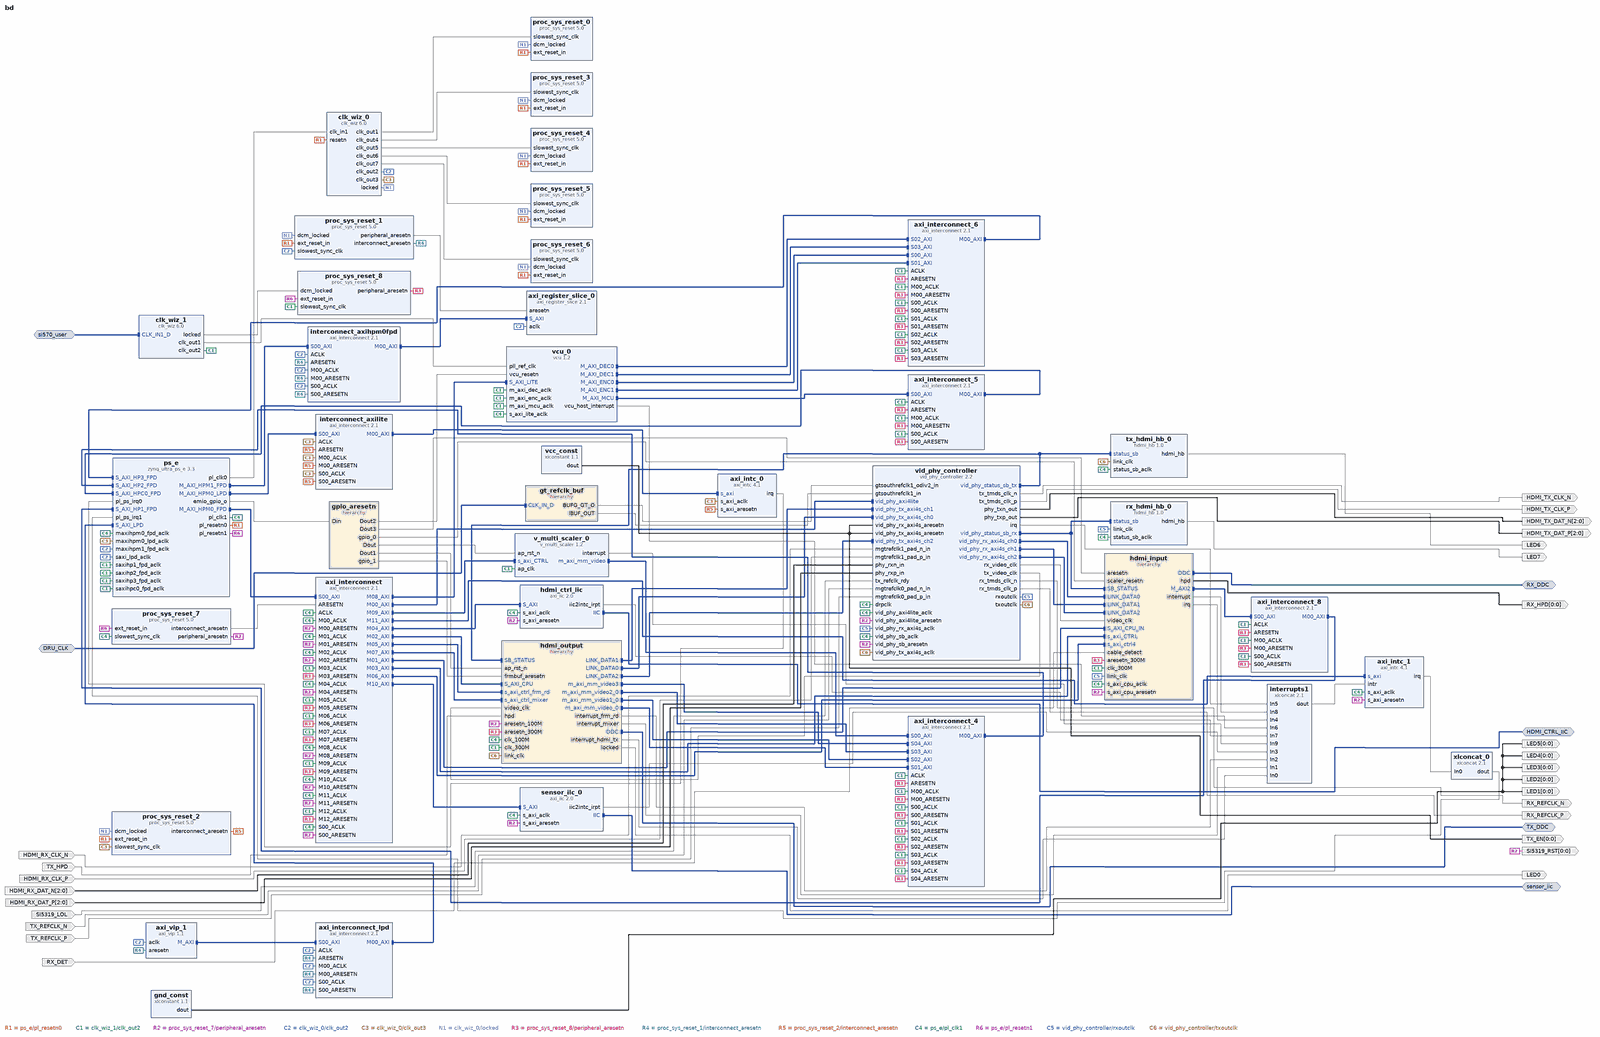
[diagram p0: block diagram of the top level, whole]
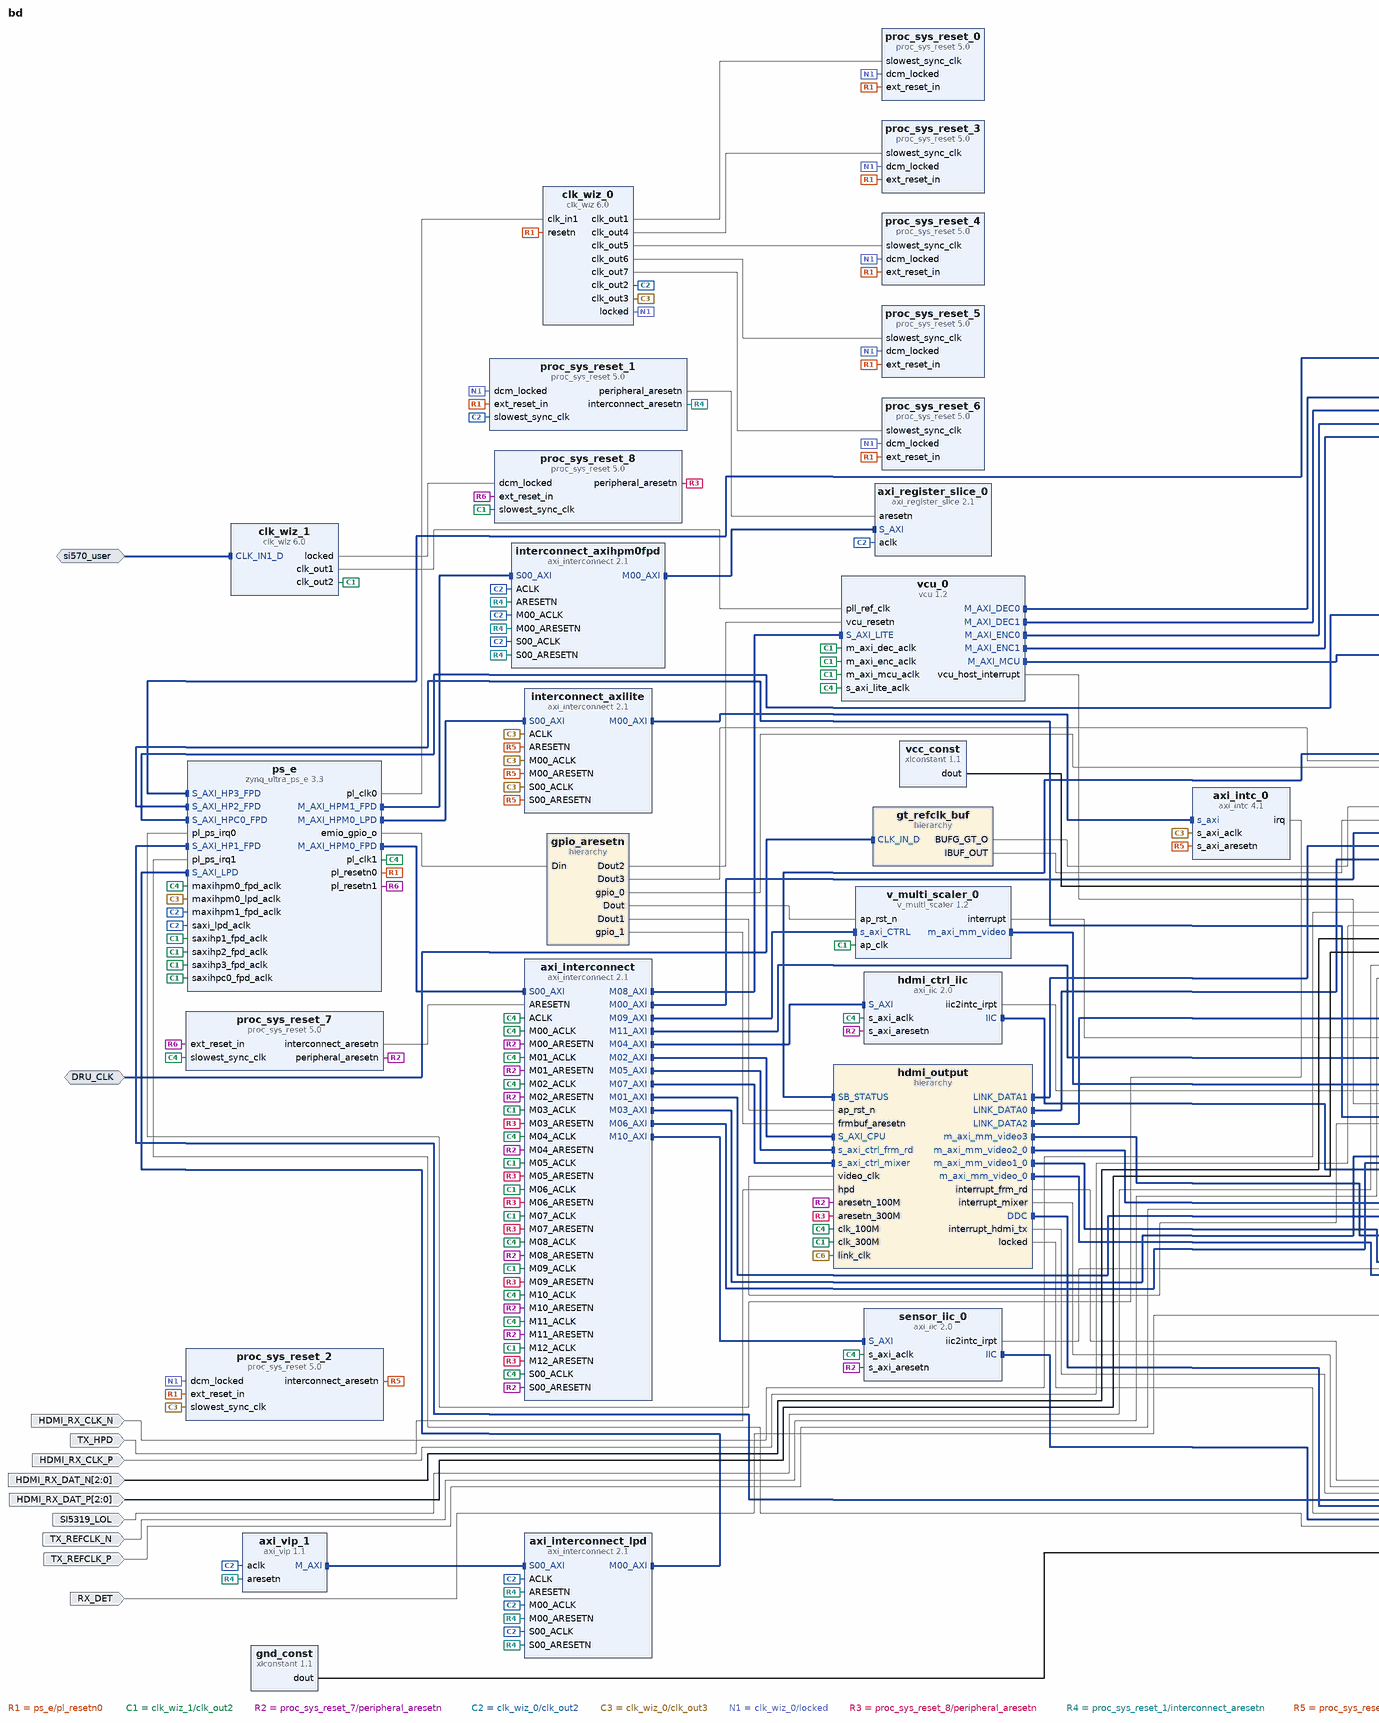
[diagram p1: block diagram of the top level, left part]
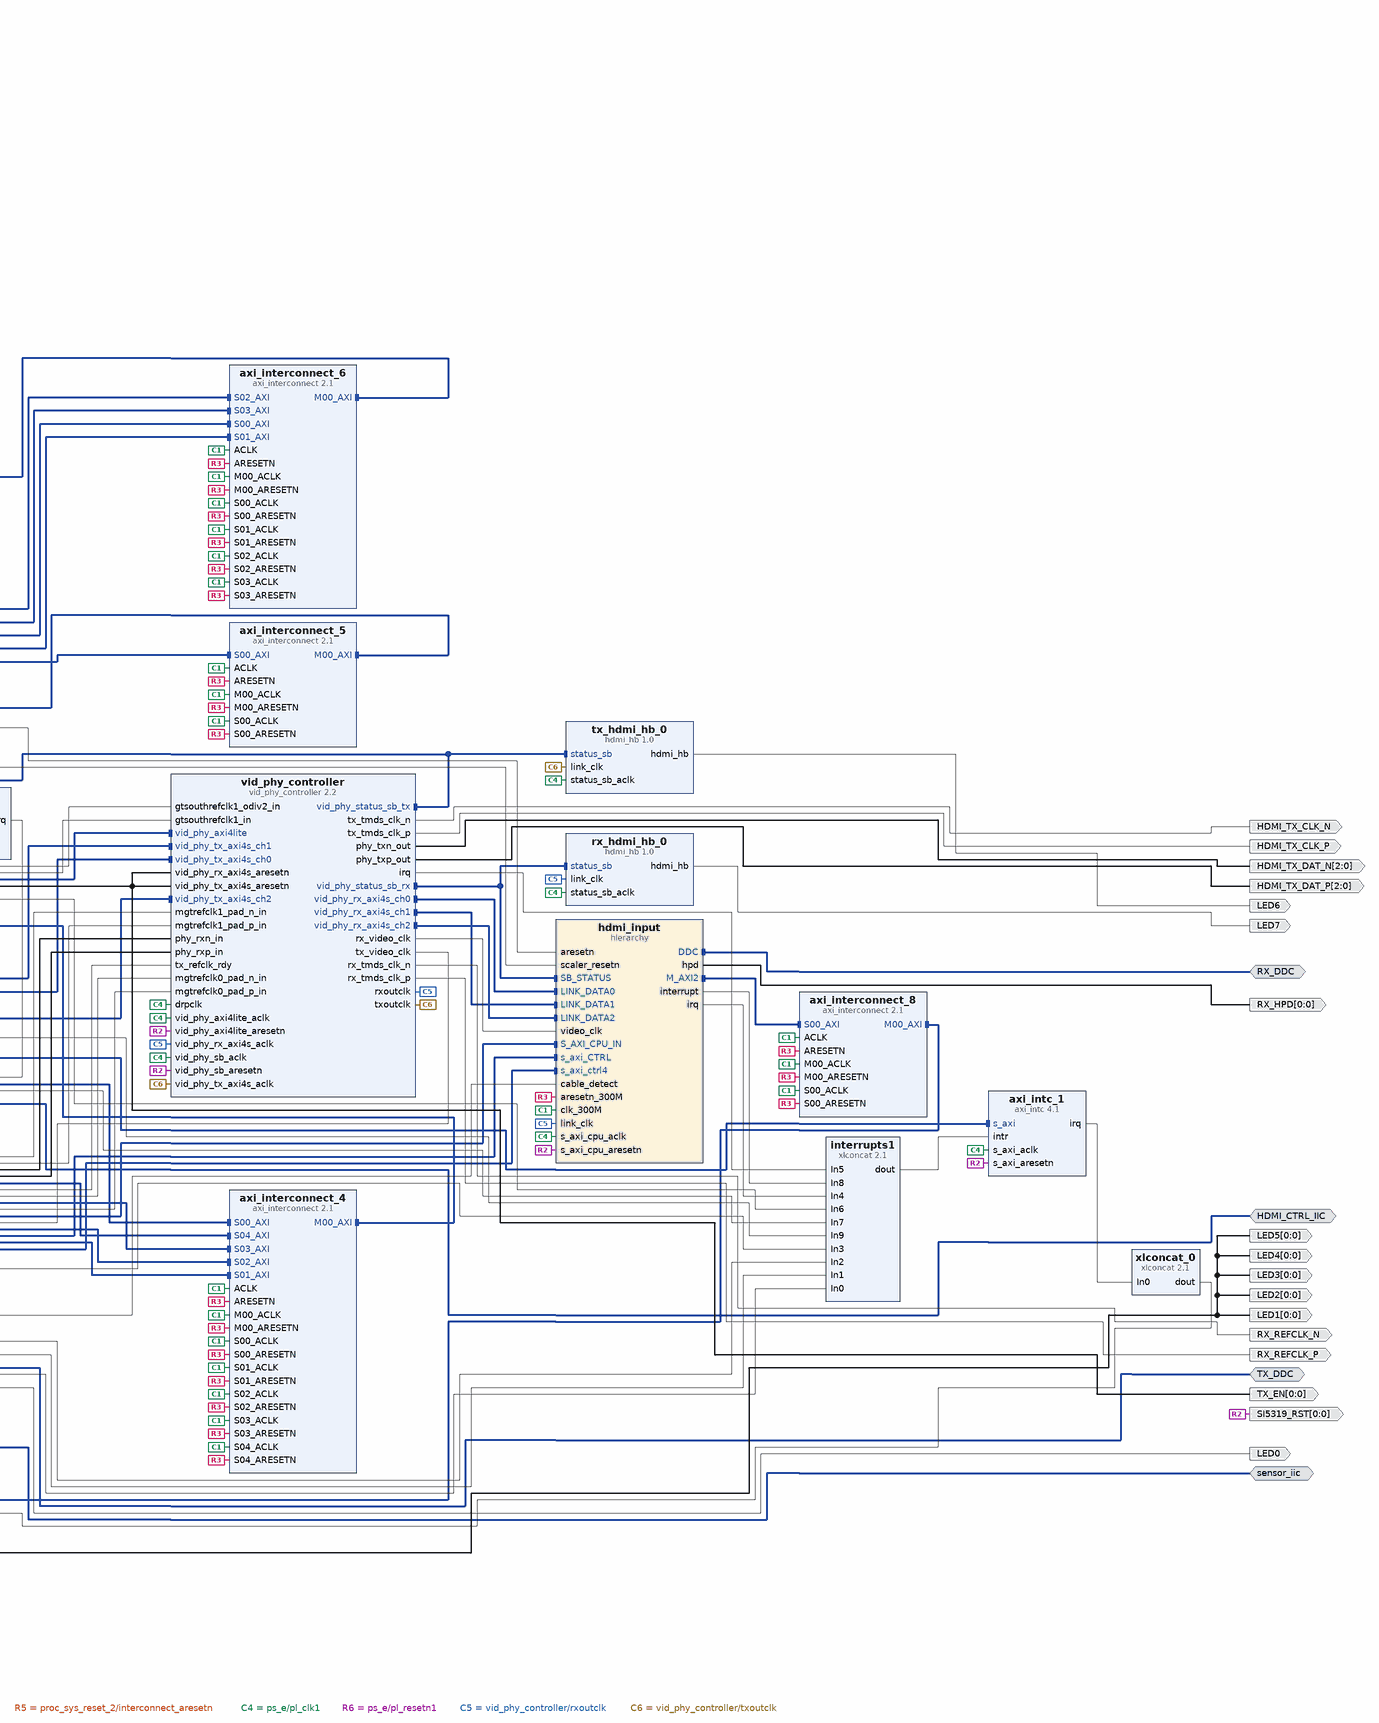
[diagram p2: block diagram of the top level, right part]
# Vivado block design bd, xczu7ev-ffvc1156-2-e, Vivado 2020.2
create_bd_design bd

create_bd_intf_port -mode Slave -vlnv xilinx.com:interface:diff_clock_rtl:1.0 DRU_CLK
set_property -dict {CONFIG.FREQ_HZ 156250000} [get_bd_intf_ports DRU_CLK]
create_bd_intf_port -mode Master -vlnv xilinx.com:interface:iic_rtl:1.0 HDMI_CTRL_IIC
create_bd_intf_port -mode Master -vlnv xilinx.com:interface:iic_rtl:1.0 RX_DDC
create_bd_intf_port -mode Master -vlnv xilinx.com:interface:iic_rtl:1.0 TX_DDC
create_bd_intf_port -mode Master -vlnv xilinx.com:interface:iic_rtl:1.0 sensor_iic
create_bd_intf_port -mode Slave -vlnv xilinx.com:interface:diff_clock_rtl:1.0 si570_user
set_property -dict {CONFIG.FREQ_HZ 300000000} [get_bd_intf_ports si570_user]
create_bd_port -dir I HDMI_RX_CLK_N
create_bd_port -dir I HDMI_RX_CLK_P
create_bd_port -dir I -from 2 -to 0 HDMI_RX_DAT_N
create_bd_port -dir I -from 2 -to 0 HDMI_RX_DAT_P
create_bd_port -dir O HDMI_TX_CLK_N
create_bd_port -dir O HDMI_TX_CLK_P
create_bd_port -dir O -from 2 -to 0 HDMI_TX_DAT_N
create_bd_port -dir O -from 2 -to 0 HDMI_TX_DAT_P
create_bd_port -dir O LED0
create_bd_port -dir O -from 0 -to 0 LED1
create_bd_port -dir O -from 0 -to 0 LED2
create_bd_port -dir O -from 0 -to 0 LED3
create_bd_port -dir O -from 0 -to 0 LED4
create_bd_port -dir O -from 0 -to 0 LED5
create_bd_port -dir O LED6
create_bd_port -dir O LED7
create_bd_port -dir I RX_DET
create_bd_port -dir O -from 0 -to 0 RX_HPD
create_bd_port -dir O RX_REFCLK_N
create_bd_port -dir O RX_REFCLK_P
create_bd_port -dir I SI5319_LOL
create_bd_port -dir O -from 0 -to 0 SI5319_RST
create_bd_port -dir O -from 0 -to 0 TX_EN
create_bd_port -dir I TX_HPD
create_bd_port -dir I TX_REFCLK_N
create_bd_port -dir I TX_REFCLK_P

create_bd_cell -type ip -vlnv xilinx.com:ip:axi_intc:4.1 axi_intc_0
set_property -dict {CONFIG.C_ASYNC_INTR 0xFFFFFFFF CONFIG.C_IRQ_CONNECTION 1 CONFIG.C_IRQ_IS_LEVEL 1} [get_bd_cells axi_intc_0]
create_bd_cell -type ip -vlnv xilinx.com:ip:axi_intc:4.1 axi_intc_1
set_property -dict {CONFIG.C_IRQ_CONNECTION 1} [get_bd_cells axi_intc_1]
create_bd_cell -type ip -vlnv xilinx.com:ip:axi_interconnect:2.1 axi_interconnect
set_property -dict {CONFIG.ENABLE_ADVANCED_OPTIONS 1 CONFIG.NUM_MI 13} [get_bd_cells axi_interconnect]
create_bd_cell -type ip -vlnv xilinx.com:ip:axi_interconnect:2.1 axi_interconnect_4
set_property -dict [list \
  CONFIG.ENABLE_ADVANCED_OPTIONS 1 \
  CONFIG.M00_HAS_REGSLICE 4 \
  CONFIG.NUM_MI 1 \
  CONFIG.NUM_SI 5 \
  CONFIG.S00_HAS_REGSLICE 4 \
  CONFIG.S01_HAS_REGSLICE 4 \
  CONFIG.S02_HAS_REGSLICE 4 \
  CONFIG.S03_HAS_REGSLICE 4 \
  CONFIG.S04_HAS_REGSLICE 4 \
  CONFIG.S05_HAS_REGSLICE 4 \
  CONFIG.S06_HAS_REGSLICE 4 \
  CONFIG.S07_HAS_REGSLICE 4 \
  CONFIG.S08_HAS_REGSLICE 4 \
  CONFIG.S09_HAS_REGSLICE 4 \
] [get_bd_cells axi_interconnect_4]
create_bd_cell -type ip -vlnv xilinx.com:ip:axi_interconnect:2.1 axi_interconnect_5
set_property -dict {CONFIG.ENABLE_ADVANCED_OPTIONS 1 CONFIG.NUM_MI 1 CONFIG.S00_HAS_REGSLICE 4} [get_bd_cells axi_interconnect_5]
create_bd_cell -type ip -vlnv xilinx.com:ip:axi_interconnect:2.1 axi_interconnect_6
set_property -dict [list \
  CONFIG.ENABLE_ADVANCED_OPTIONS 1 \
  CONFIG.M00_HAS_REGSLICE 0 \
  CONFIG.NUM_MI 1 \
  CONFIG.NUM_SI 4 \
  CONFIG.S00_HAS_REGSLICE 4 \
  CONFIG.S01_HAS_REGSLICE 4 \
  CONFIG.S02_HAS_REGSLICE 4 \
  CONFIG.S03_HAS_REGSLICE 4 \
] [get_bd_cells axi_interconnect_6]
create_bd_cell -type ip -vlnv xilinx.com:ip:axi_interconnect:2.1 axi_interconnect_8
set_property -dict [list \
  CONFIG.ENABLE_ADVANCED_OPTIONS 1 \
  CONFIG.NUM_MI 1 \
  CONFIG.NUM_SI 1 \
  CONFIG.S00_HAS_REGSLICE 4 \
] [get_bd_cells axi_interconnect_8]
create_bd_cell -type ip -vlnv xilinx.com:ip:axi_interconnect:2.1 axi_interconnect_lpd
set_property -dict {CONFIG.NUM_MI 1} [get_bd_cells axi_interconnect_lpd]
create_bd_cell -type ip -vlnv xilinx.com:ip:axi_register_slice:2.1 axi_register_slice_0
set_property -dict {CONFIG.DATA_WIDTH 128} [get_bd_cells axi_register_slice_0]
create_bd_cell -type ip -vlnv xilinx.com:ip:axi_vip:1.1 axi_vip_1
set_property -dict [list \
  CONFIG.ADDR_WIDTH 32 \
  CONFIG.ARUSER_WIDTH 0 \
  CONFIG.AWUSER_WIDTH 0 \
  CONFIG.BUSER_WIDTH 0 \
  CONFIG.DATA_WIDTH 32 \
  CONFIG.HAS_BRESP 1 \
  CONFIG.HAS_BURST 1 \
  CONFIG.HAS_CACHE 1 \
  CONFIG.HAS_LOCK 1 \
  CONFIG.HAS_PROT 1 \
  CONFIG.HAS_QOS 1 \
  CONFIG.HAS_REGION 1 \
  CONFIG.HAS_RRESP 1 \
  CONFIG.HAS_WSTRB 1 \
  CONFIG.ID_WIDTH 0 \
  CONFIG.INTERFACE_MODE MASTER \
  CONFIG.PROTOCOL AXI4 \
  CONFIG.READ_WRITE_MODE READ_WRITE \
  CONFIG.RUSER_BITS_PER_BYTE 0 \
  CONFIG.RUSER_WIDTH 0 \
  CONFIG.SUPPORTS_NARROW 1 \
  CONFIG.WUSER_BITS_PER_BYTE 0 \
  CONFIG.WUSER_WIDTH 0 \
] [get_bd_cells axi_vip_1]
create_bd_cell -type ip -vlnv xilinx.com:ip:clk_wiz:6.0 clk_wiz_0
set_property -dict [list \
  CONFIG.CLKIN1_JITTER_PS 100.01 \
  CONFIG.CLKOUT1_JITTER 107.579 \
  CONFIG.CLKOUT1_PHASE_ERROR 87.187 \
  CONFIG.CLKOUT1_REQUESTED_OUT_FREQ 150 \
  CONFIG.CLKOUT2_JITTER 94.872 \
  CONFIG.CLKOUT2_PHASE_ERROR 87.187 \
  CONFIG.CLKOUT2_REQUESTED_OUT_FREQ 300 \
  CONFIG.CLKOUT2_USED true \
  CONFIG.CLKOUT3_JITTER 122.171 \
  CONFIG.CLKOUT3_PHASE_ERROR 87.187 \
  CONFIG.CLKOUT3_REQUESTED_OUT_FREQ 75 \
  CONFIG.CLKOUT3_USED true \
  CONFIG.CLKOUT4_JITTER 115.843 \
  CONFIG.CLKOUT4_PHASE_ERROR 87.187 \
  CONFIG.CLKOUT4_REQUESTED_OUT_FREQ 100.000 \
  CONFIG.CLKOUT4_USED true \
  CONFIG.CLKOUT5_JITTER 102.096 \
  CONFIG.CLKOUT5_PHASE_ERROR 87.187 \
  CONFIG.CLKOUT5_REQUESTED_OUT_FREQ 200.000 \
  CONFIG.CLKOUT5_USED true \
  CONFIG.CLKOUT6_JITTER 90.083 \
  CONFIG.CLKOUT6_PHASE_ERROR 87.187 \
  CONFIG.CLKOUT6_REQUESTED_OUT_FREQ 400.000 \
  CONFIG.CLKOUT6_USED true \
  CONFIG.CLKOUT7_JITTER 83.777 \
  CONFIG.CLKOUT7_PHASE_ERROR 87.187 \
  CONFIG.CLKOUT7_REQUESTED_OUT_FREQ 600.000 \
  CONFIG.CLKOUT7_USED true \
  CONFIG.MMCM_CLKFBOUT_MULT_F 12.000 \
  CONFIG.MMCM_CLKIN1_PERIOD 10.001 \
  CONFIG.MMCM_CLKOUT0_DIVIDE_F 8.000 \
  CONFIG.MMCM_CLKOUT1_DIVIDE 4 \
  CONFIG.MMCM_CLKOUT2_DIVIDE 16 \
  CONFIG.MMCM_CLKOUT3_DIVIDE 12 \
  CONFIG.MMCM_CLKOUT4_DIVIDE 6 \
  CONFIG.MMCM_CLKOUT5_DIVIDE 3 \
  CONFIG.MMCM_CLKOUT6_DIVIDE 2 \
  CONFIG.MMCM_DIVCLK_DIVIDE 1 \
  CONFIG.NUM_OUT_CLKS 7 \
  CONFIG.RESET_PORT resetn \
  CONFIG.RESET_TYPE ACTIVE_LOW \
] [get_bd_cells clk_wiz_0]
create_bd_cell -type ip -vlnv xilinx.com:ip:clk_wiz:6.0 clk_wiz_1
set_property -dict [list \
  CONFIG.CLKIN1_JITTER_PS 100.000 \
  CONFIG.CLKIN1_UI_JITTER 100.000 \
  CONFIG.CLKIN2_JITTER_PS 100.000 \
  CONFIG.CLKIN2_UI_JITTER 100.000 \
  CONFIG.CLKOUT1_JITTER 130.356 \
  CONFIG.CLKOUT1_PHASE_ERROR 77.836 \
  CONFIG.CLKOUT1_REQUESTED_OUT_FREQ 33.33 \
  CONFIG.CLKOUT2_JITTER 83.751 \
  CONFIG.CLKOUT2_PHASE_ERROR 77.836 \
  CONFIG.CLKOUT2_REQUESTED_OUT_FREQ 300 \
  CONFIG.CLKOUT2_USED true \
  CONFIG.CLKOUT3_JITTER 90.370 \
  CONFIG.CLKOUT3_PHASE_ERROR 77.836 \
  CONFIG.CLKOUT3_REQUESTED_OUT_FREQ 200.000 \
  CONFIG.CLKOUT3_USED true \
  CONFIG.CLKOUT4_JITTER 103.044 \
  CONFIG.CLKOUT4_PHASE_ERROR 77.836 \
  CONFIG.CLKOUT4_REQUESTED_OUT_FREQ 100.000 \
  CONFIG.CLKOUT4_USED false \
  CONFIG.ENABLE_CLOCK_MONITOR false \
  CONFIG.JITTER_OPTIONS PS \
  CONFIG.MMCM_CLKFBOUT_MULT_F 4.000 \
  CONFIG.MMCM_CLKIN1_PERIOD 3.333 \
  CONFIG.MMCM_CLKIN2_PERIOD 10.0 \
  CONFIG.MMCM_CLKOUT0_DIVIDE_F 36.000 \
  CONFIG.MMCM_CLKOUT1_DIVIDE 4 \
  CONFIG.MMCM_CLKOUT2_DIVIDE 6 \
  CONFIG.MMCM_CLKOUT3_DIVIDE 1 \
  CONFIG.MMCM_DIVCLK_DIVIDE 1 \
  CONFIG.MMCM_REF_JITTER1 0.030 \
  CONFIG.MMCM_REF_JITTER2 0.010 \
  CONFIG.NUM_OUT_CLKS 3 \
  CONFIG.PRIMITIVE MMCM \
  CONFIG.PRIM_IN_FREQ 300.000 \
  CONFIG.PRIM_SOURCE Differential_clock_capable_pin \
  CONFIG.SECONDARY_SOURCE Single_ended_clock_capable_pin \
  CONFIG.USE_INCLK_SWITCHOVER false \
  CONFIG.USE_PHASE_ALIGNMENT true \
  CONFIG.USE_RESET false \
] [get_bd_cells clk_wiz_1]
create_bd_cell -type ip -vlnv xilinx.com:ip:xlconstant:1.1 gnd_const
set_property -dict {CONFIG.CONST_VAL 0} [get_bd_cells gnd_const]
create_bd_cell -type hier gpio_aresetn
create_bd_cell -type hier gt_refclk_buf
create_bd_cell -type ip -vlnv xilinx.com:ip:axi_iic:2.0 hdmi_ctrl_iic
set_property -dict {CONFIG.IIC_BOARD_INTERFACE Custom CONFIG.USE_BOARD_FLOW true} [get_bd_cells hdmi_ctrl_iic]
create_bd_cell -type hier hdmi_input
create_bd_cell -type hier hdmi_output
create_bd_cell -type ip -vlnv xilinx.com:ip:axi_interconnect:2.1 interconnect_axihpm0fpd
set_property -dict {CONFIG.NUM_MI 1} [get_bd_cells interconnect_axihpm0fpd]
create_bd_cell -type ip -vlnv xilinx.com:ip:axi_interconnect:2.1 interconnect_axilite
set_property -dict {CONFIG.NUM_MI 1} [get_bd_cells interconnect_axilite]
create_bd_cell -type ip -vlnv xilinx.com:ip:xlconcat:2.1 interrupts1
set_property -dict {CONFIG.NUM_PORTS 10} [get_bd_cells interrupts1]
create_bd_cell -type ip -vlnv xilinx.com:ip:proc_sys_reset:5.0 proc_sys_reset_0
create_bd_cell -type ip -vlnv xilinx.com:ip:proc_sys_reset:5.0 proc_sys_reset_1
create_bd_cell -type ip -vlnv xilinx.com:ip:proc_sys_reset:5.0 proc_sys_reset_2
create_bd_cell -type ip -vlnv xilinx.com:ip:proc_sys_reset:5.0 proc_sys_reset_3
create_bd_cell -type ip -vlnv xilinx.com:ip:proc_sys_reset:5.0 proc_sys_reset_4
create_bd_cell -type ip -vlnv xilinx.com:ip:proc_sys_reset:5.0 proc_sys_reset_5
create_bd_cell -type ip -vlnv xilinx.com:ip:proc_sys_reset:5.0 proc_sys_reset_6
create_bd_cell -type ip -vlnv xilinx.com:ip:proc_sys_reset:5.0 proc_sys_reset_7
create_bd_cell -type ip -vlnv xilinx.com:ip:proc_sys_reset:5.0 proc_sys_reset_8
create_bd_cell -type ip -vlnv xilinx.com:ip:zynq_ultra_ps_e:3.3 ps_e
set_property -dict [list \
  CONFIG.PSU_BANK_0_IO_STANDARD LVCMOS18 \
  CONFIG.PSU_BANK_1_IO_STANDARD LVCMOS18 \
  CONFIG.PSU_BANK_2_IO_STANDARD LVCMOS18 \
  CONFIG.PSU_DYNAMIC_DDR_CONFIG_EN 1 \
  CONFIG.PSU_USB3__DUAL_CLOCK_ENABLE 1 \
  CONFIG.PSU__CAN1__PERIPHERAL__ENABLE 1 \
  CONFIG.PSU__CAN1__PERIPHERAL__IO {MIO 24 .. 25} \
  CONFIG.PSU__CRF_APB__ACPU_CTRL__FREQMHZ 1200 \
  CONFIG.PSU__CRF_APB__ACPU_CTRL__SRCSEL APLL \
  CONFIG.PSU__CRF_APB__APLL_CTRL__SRCSEL PSS_REF_CLK \
  CONFIG.PSU__CRF_APB__DBG_FPD_CTRL__FREQMHZ 250 \
  CONFIG.PSU__CRF_APB__DBG_FPD_CTRL__SRCSEL IOPLL \
  CONFIG.PSU__CRF_APB__DBG_TRACE_CTRL__FREQMHZ 250 \
  CONFIG.PSU__CRF_APB__DBG_TRACE_CTRL__SRCSEL IOPLL \
  CONFIG.PSU__CRF_APB__DBG_TSTMP_CTRL__FREQMHZ 250 \
  CONFIG.PSU__CRF_APB__DBG_TSTMP_CTRL__SRCSEL IOPLL \
  CONFIG.PSU__CRF_APB__DDR_CTRL__FREQMHZ 1067 \
  CONFIG.PSU__CRF_APB__DDR_CTRL__SRCSEL DPLL \
  CONFIG.PSU__CRF_APB__DPDMA_REF_CTRL__FREQMHZ 600 \
  CONFIG.PSU__CRF_APB__DPDMA_REF_CTRL__SRCSEL APLL \
  CONFIG.PSU__CRF_APB__DPLL_CTRL__SRCSEL PSS_REF_CLK \
  CONFIG.PSU__CRF_APB__DP_AUDIO_REF_CTRL__SRCSEL RPLL \
  CONFIG.PSU__CRF_APB__DP_STC_REF_CTRL__SRCSEL RPLL \
  CONFIG.PSU__CRF_APB__DP_VIDEO_REF_CTRL__SRCSEL VPLL \
  CONFIG.PSU__CRF_APB__GDMA_REF_CTRL__FREQMHZ 600 \
  CONFIG.PSU__CRF_APB__GDMA_REF_CTRL__SRCSEL APLL \
  CONFIG.PSU__CRF_APB__GPU_REF_CTRL__FREQMHZ 500 \
  CONFIG.PSU__CRF_APB__GPU_REF_CTRL__SRCSEL IOPLL \
  CONFIG.PSU__CRF_APB__TOPSW_LSBUS_CTRL__FREQMHZ 100 \
  CONFIG.PSU__CRF_APB__TOPSW_LSBUS_CTRL__SRCSEL IOPLL \
  CONFIG.PSU__CRF_APB__TOPSW_MAIN_CTRL__FREQMHZ 533.33 \
  CONFIG.PSU__CRF_APB__TOPSW_MAIN_CTRL__SRCSEL DPLL \
  CONFIG.PSU__CRF_APB__VPLL_CTRL__SRCSEL PSS_REF_CLK \
  CONFIG.PSU__CRL_APB__ADMA_REF_CTRL__FREQMHZ 500 \
  CONFIG.PSU__CRL_APB__ADMA_REF_CTRL__SRCSEL IOPLL \
  CONFIG.PSU__CRL_APB__CAN1_REF_CTRL__FREQMHZ 100 \
  CONFIG.PSU__CRL_APB__CAN1_REF_CTRL__SRCSEL IOPLL \
  CONFIG.PSU__CRL_APB__CPU_R5_CTRL__FREQMHZ 500 \
  CONFIG.PSU__CRL_APB__CPU_R5_CTRL__SRCSEL IOPLL \
  CONFIG.PSU__CRL_APB__DBG_LPD_CTRL__FREQMHZ 250 \
  CONFIG.PSU__CRL_APB__DBG_LPD_CTRL__SRCSEL IOPLL \
  CONFIG.PSU__CRL_APB__GEM3_REF_CTRL__FREQMHZ 125 \
  CONFIG.PSU__CRL_APB__GEM3_REF_CTRL__SRCSEL IOPLL \
  CONFIG.PSU__CRL_APB__I2C0_REF_CTRL__FREQMHZ 100 \
  CONFIG.PSU__CRL_APB__I2C0_REF_CTRL__SRCSEL IOPLL \
  CONFIG.PSU__CRL_APB__I2C1_REF_CTRL__FREQMHZ 100 \
  CONFIG.PSU__CRL_APB__I2C1_REF_CTRL__SRCSEL IOPLL \
  CONFIG.PSU__CRL_APB__IOPLL_CTRL__SRCSEL PSS_REF_CLK \
  CONFIG.PSU__CRL_APB__IOU_SWITCH_CTRL__FREQMHZ 250 \
  CONFIG.PSU__CRL_APB__IOU_SWITCH_CTRL__SRCSEL IOPLL \
  CONFIG.PSU__CRL_APB__LPD_LSBUS_CTRL__FREQMHZ 100 \
  CONFIG.PSU__CRL_APB__LPD_LSBUS_CTRL__SRCSEL IOPLL \
  CONFIG.PSU__CRL_APB__LPD_SWITCH_CTRL__FREQMHZ 500 \
  CONFIG.PSU__CRL_APB__LPD_SWITCH_CTRL__SRCSEL IOPLL \
  CONFIG.PSU__CRL_APB__PCAP_CTRL__FREQMHZ 200 \
  CONFIG.PSU__CRL_APB__PCAP_CTRL__SRCSEL IOPLL \
  CONFIG.PSU__CRL_APB__PL0_REF_CTRL__FREQMHZ 100 \
  CONFIG.PSU__CRL_APB__PL0_REF_CTRL__SRCSEL IOPLL \
  CONFIG.PSU__CRL_APB__PL1_REF_CTRL__SRCSEL IOPLL \
  CONFIG.PSU__CRL_APB__QSPI_REF_CTRL__FREQMHZ 125 \
  CONFIG.PSU__CRL_APB__QSPI_REF_CTRL__SRCSEL IOPLL \
  CONFIG.PSU__CRL_APB__RPLL_CTRL__SRCSEL PSS_REF_CLK \
  CONFIG.PSU__CRL_APB__SDIO1_REF_CTRL__FREQMHZ 200 \
  CONFIG.PSU__CRL_APB__SDIO1_REF_CTRL__SRCSEL IOPLL \
  CONFIG.PSU__CRL_APB__TIMESTAMP_REF_CTRL__FREQMHZ 100 \
  CONFIG.PSU__CRL_APB__TIMESTAMP_REF_CTRL__SRCSEL IOPLL \
  CONFIG.PSU__CRL_APB__UART0_REF_CTRL__FREQMHZ 100 \
  CONFIG.PSU__CRL_APB__UART0_REF_CTRL__SRCSEL IOPLL \
  CONFIG.PSU__CRL_APB__UART1_REF_CTRL__FREQMHZ 100 \
  CONFIG.PSU__CRL_APB__UART1_REF_CTRL__SRCSEL IOPLL \
  CONFIG.PSU__CRL_APB__USB0_BUS_REF_CTRL__FREQMHZ 250 \
  CONFIG.PSU__CRL_APB__USB0_BUS_REF_CTRL__SRCSEL IOPLL \
  CONFIG.PSU__CRL_APB__USB3_DUAL_REF_CTRL__FREQMHZ 20 \
  CONFIG.PSU__CRL_APB__USB3_DUAL_REF_CTRL__SRCSEL IOPLL \
  CONFIG.PSU__CRL_APB__USB3__ENABLE 1 \
  CONFIG.PSU__CSUPMU__PERIPHERAL__VALID 1 \
  CONFIG.PSU__DDRC__BUS_WIDTH {64 Bit} \
  CONFIG.PSU__DDRC__COMPONENTS UDIMM \
  CONFIG.PSU__DDRC__DEVICE_CAPACITY {4096 MBits} \
  CONFIG.PSU__DDRC__DRAM_WIDTH {8 Bits} \
  CONFIG.PSU__DDRC__ECC Disabled \
  CONFIG.PSU__DDRC__MEMORY_TYPE {DDR 4} \
  CONFIG.PSU__DDRC__SPEED_BIN DDR4_2133P \
  CONFIG.PSU__DDR_HIGH_ADDRESS_GUI_ENABLE 1 \
  CONFIG.PSU__DDR__INTERFACE__FREQMHZ 533.500 \
  CONFIG.PSU__DISPLAYPORT__LANE0__ENABLE 1 \
  CONFIG.PSU__DISPLAYPORT__LANE0__IO {GT Lane1} \
  CONFIG.PSU__DISPLAYPORT__LANE1__ENABLE 1 \
  CONFIG.PSU__DISPLAYPORT__LANE1__IO {GT Lane0} \
  CONFIG.PSU__DISPLAYPORT__PERIPHERAL__ENABLE 1 \
  CONFIG.PSU__DLL__ISUSED 1 \
  CONFIG.PSU__DPAUX__PERIPHERAL__ENABLE 1 \
  CONFIG.PSU__DPAUX__PERIPHERAL__IO {MIO 27 .. 30} \
  CONFIG.PSU__DP__LANE_SEL {Dual Lower} \
  CONFIG.PSU__DP__REF_CLK_FREQ 27 \
  CONFIG.PSU__DP__REF_CLK_SEL {Ref Clk3} \
  CONFIG.PSU__ENET3__FIFO__ENABLE 0 \
  CONFIG.PSU__ENET3__GRP_MDIO__ENABLE 1 \
  CONFIG.PSU__ENET3__GRP_MDIO__IO {MIO 76 .. 77} \
  CONFIG.PSU__ENET3__PERIPHERAL__ENABLE 1 \
  CONFIG.PSU__ENET3__PERIPHERAL__IO {MIO 64 .. 75} \
  CONFIG.PSU__ENET3__PTP__ENABLE 0 \
  CONFIG.PSU__ENET3__TSU__ENABLE 0 \
  CONFIG.PSU__FPGA_PL0_ENABLE 1 \
  CONFIG.PSU__FPGA_PL1_ENABLE 1 \
  CONFIG.PSU__GEM3_COHERENCY 0 \
  CONFIG.PSU__GEM3_ROUTE_THROUGH_FPD 0 \
  CONFIG.PSU__GEM__TSU__ENABLE 0 \
  CONFIG.PSU__GPIO0_MIO__IO {MIO 0 .. 25} \
  CONFIG.PSU__GPIO0_MIO__PERIPHERAL__ENABLE 1 \
  CONFIG.PSU__GPIO1_MIO__IO {MIO 26 .. 51} \
  CONFIG.PSU__GPIO1_MIO__PERIPHERAL__ENABLE 1 \
  CONFIG.PSU__GPIO_EMIO_WIDTH 94 \
  CONFIG.PSU__GPIO_EMIO__PERIPHERAL__ENABLE 1 \
  CONFIG.PSU__GPIO_EMIO__PERIPHERAL__IO 94 \
  CONFIG.PSU__GPIO_EMIO__WIDTH {[93:0]} \
  CONFIG.PSU__GT__LINK_SPEED HBR \
  CONFIG.PSU__GT__PRE_EMPH_LVL_4 0 \
  CONFIG.PSU__GT__VLT_SWNG_LVL_4 0 \
  CONFIG.PSU__I2C0__PERIPHERAL__ENABLE 1 \
  CONFIG.PSU__I2C0__PERIPHERAL__IO {MIO 14 .. 15} \
  CONFIG.PSU__I2C1__PERIPHERAL__ENABLE 1 \
  CONFIG.PSU__I2C1__PERIPHERAL__IO {MIO 16 .. 17} \
  CONFIG.PSU__IOU_SLCR__IOU_TTC_APB_CLK__TTC0_SEL APB \
  CONFIG.PSU__IOU_SLCR__IOU_TTC_APB_CLK__TTC1_SEL APB \
  CONFIG.PSU__IOU_SLCR__IOU_TTC_APB_CLK__TTC2_SEL APB \
  CONFIG.PSU__IOU_SLCR__IOU_TTC_APB_CLK__TTC3_SEL APB \
  CONFIG.PSU__MAXIGP0__DATA_WIDTH 128 \
  CONFIG.PSU__NUM_FABRIC_RESETS 2 \
  CONFIG.PSU__OVERRIDE__BASIC_CLOCK 0 \
  CONFIG.PSU__PMU_COHERENCY 0 \
  CONFIG.PSU__PMU__AIBACK__ENABLE 0 \
  CONFIG.PSU__PMU__EMIO_GPI__ENABLE 0 \
  CONFIG.PSU__PMU__EMIO_GPO__ENABLE 0 \
  CONFIG.PSU__PMU__GPI0__ENABLE 0 \
  CONFIG.PSU__PMU__GPI1__ENABLE 0 \
  CONFIG.PSU__PMU__GPI2__ENABLE 0 \
  CONFIG.PSU__PMU__GPI3__ENABLE 0 \
  CONFIG.PSU__PMU__GPI4__ENABLE 0 \
  CONFIG.PSU__PMU__GPI5__ENABLE 0 \
  CONFIG.PSU__PMU__GPO0__ENABLE 1 \
  CONFIG.PSU__PMU__GPO0__IO {MIO 32} \
  CONFIG.PSU__PMU__GPO1__ENABLE 1 \
  CONFIG.PSU__PMU__GPO1__IO {MIO 33} \
  CONFIG.PSU__PMU__GPO2__ENABLE 1 \
  CONFIG.PSU__PMU__GPO2__IO {MIO 34} \
  CONFIG.PSU__PMU__GPO2__POLARITY low \
  CONFIG.PSU__PMU__GPO3__ENABLE 1 \
  CONFIG.PSU__PMU__GPO3__IO {MIO 35} \
  CONFIG.PSU__PMU__GPO3__POLARITY low \
  CONFIG.PSU__PMU__GPO4__ENABLE 1 \
  CONFIG.PSU__PMU__GPO4__IO {MIO 36} \
  CONFIG.PSU__PMU__GPO4__POLARITY low \
  CONFIG.PSU__PMU__GPO5__ENABLE 1 \
  CONFIG.PSU__PMU__GPO5__IO {MIO 37} \
  CONFIG.PSU__PMU__GPO5__POLARITY low \
  CONFIG.PSU__PMU__PERIPHERAL__ENABLE 1 \
  CONFIG.PSU__PMU__PLERROR__ENABLE 0 \
  CONFIG.PSU__PRESET_APPLIED 1 \
  CONFIG.PSU__PSS_REF_CLK__FREQMHZ 33.330 \
  CONFIG.PSU__QSPI_COHERENCY 0 \
  CONFIG.PSU__QSPI_ROUTE_THROUGH_FPD 0 \
  CONFIG.PSU__QSPI__GRP_FBCLK__ENABLE 1 \
  CONFIG.PSU__QSPI__GRP_FBCLK__IO {MIO 6} \
  CONFIG.PSU__QSPI__PERIPHERAL__DATA_MODE x4 \
  CONFIG.PSU__QSPI__PERIPHERAL__ENABLE 1 \
  CONFIG.PSU__QSPI__PERIPHERAL__IO {MIO 0 .. 12} \
  CONFIG.PSU__QSPI__PERIPHERAL__MODE {Dual Parallel} \
  CONFIG.PSU__SATA__LANE1__IO {GT Lane3} \
  CONFIG.PSU__SATA__PERIPHERAL__ENABLE 1 \
  CONFIG.PSU__SATA__REF_CLK_FREQ 125 \
  CONFIG.PSU__SATA__REF_CLK_SEL {Ref Clk1} \
  CONFIG.PSU__SAXIGP6__DATA_WIDTH 32 \
  CONFIG.PSU__SD1_COHERENCY 0 \
  CONFIG.PSU__SD1_ROUTE_THROUGH_FPD 0 \
  CONFIG.PSU__SD1__DATA_TRANSFER_MODE 8Bit \
  CONFIG.PSU__SD1__GRP_CD__ENABLE 1 \
  CONFIG.PSU__SD1__GRP_CD__IO {MIO 45} \
  CONFIG.PSU__SD1__GRP_POW__ENABLE 1 \
  CONFIG.PSU__SD1__GRP_POW__IO {MIO 43} \
  CONFIG.PSU__SD1__GRP_WP__ENABLE 1 \
  CONFIG.PSU__SD1__GRP_WP__IO {MIO 44} \
  CONFIG.PSU__SD1__PERIPHERAL__ENABLE 1 \
  CONFIG.PSU__SD1__PERIPHERAL__IO {MIO 39 .. 51} \
  CONFIG.PSU__SD1__SLOT_TYPE {SD 3.0} \
  CONFIG.PSU__SWDT0__CLOCK__ENABLE 0 \
  CONFIG.PSU__SWDT0__PERIPHERAL__ENABLE 1 \
  CONFIG.PSU__SWDT0__RESET__ENABLE 0 \
  CONFIG.PSU__SWDT1__CLOCK__ENABLE 0 \
  CONFIG.PSU__SWDT1__PERIPHERAL__ENABLE 1 \
  CONFIG.PSU__SWDT1__RESET__ENABLE 0 \
  CONFIG.PSU__TSU__BUFG_PORT_PAIR 0 \
  CONFIG.PSU__TTC0__CLOCK__ENABLE 0 \
  CONFIG.PSU__TTC0__PERIPHERAL__ENABLE 1 \
  CONFIG.PSU__TTC0__WAVEOUT__ENABLE 0 \
  CONFIG.PSU__TTC1__CLOCK__ENABLE 0 \
  CONFIG.PSU__TTC1__PERIPHERAL__ENABLE 1 \
  CONFIG.PSU__TTC1__WAVEOUT__ENABLE 0 \
  CONFIG.PSU__TTC2__CLOCK__ENABLE 0 \
  CONFIG.PSU__TTC2__PERIPHERAL__ENABLE 1 \
  CONFIG.PSU__TTC2__WAVEOUT__ENABLE 0 \
  CONFIG.PSU__TTC3__CLOCK__ENABLE 0 \
  CONFIG.PSU__TTC3__PERIPHERAL__ENABLE 1 \
  CONFIG.PSU__TTC3__WAVEOUT__ENABLE 0 \
  CONFIG.PSU__UART0__BAUD_RATE 115200 \
  CONFIG.PSU__UART0__MODEM__ENABLE 0 \
  CONFIG.PSU__UART0__PERIPHERAL__ENABLE 1 \
  CONFIG.PSU__UART0__PERIPHERAL__IO {MIO 18 .. 19} \
  CONFIG.PSU__UART1__BAUD_RATE 115200 \
  CONFIG.PSU__UART1__MODEM__ENABLE 0 \
  CONFIG.PSU__UART1__PERIPHERAL__ENABLE 1 \
  CONFIG.PSU__UART1__PERIPHERAL__IO {MIO 20 .. 21} \
  CONFIG.PSU__USB0_COHERENCY 0 \
  CONFIG.PSU__USB0__PERIPHERAL__ENABLE 1 \
  CONFIG.PSU__USB0__PERIPHERAL__IO {MIO 52 .. 63} \
  CONFIG.PSU__USB0__REF_CLK_FREQ 26 \
  CONFIG.PSU__USB0__REF_CLK_SEL {Ref Clk2} \
  CONFIG.PSU__USB2_0__EMIO__ENABLE 0 \
  CONFIG.PSU__USB3_0__EMIO__ENABLE 0 \
  CONFIG.PSU__USB3_0__PERIPHERAL__ENABLE 1 \
  CONFIG.PSU__USB3_0__PERIPHERAL__IO {GT Lane2} \
  CONFIG.PSU__USB__RESET__MODE {Boot Pin} \
  CONFIG.PSU__USB__RESET__POLARITY {Active Low} \
  CONFIG.PSU__USE__IRQ0 1 \
  CONFIG.PSU__USE__IRQ1 1 \
  CONFIG.PSU__USE__M_AXI_GP0 1 \
  CONFIG.PSU__USE__M_AXI_GP1 1 \
  CONFIG.PSU__USE__M_AXI_GP2 1 \
  CONFIG.PSU__USE__S_AXI_GP0 1 \
  CONFIG.PSU__USE__S_AXI_GP3 1 \
  CONFIG.PSU__USE__S_AXI_GP4 1 \
  CONFIG.PSU__USE__S_AXI_GP5 1 \
  CONFIG.PSU__USE__S_AXI_GP6 1 \
  CONFIG.SUBPRESET1 Custom \
] [get_bd_cells ps_e]
# 105 more settings of ps_e are not shown: defaults, MIO pin electricals, DDR timing, and values the tool derives
create_bd_cell -type ip -vlnv xilinx.com:user:hdmi_hb:1.0 rx_hdmi_hb_0
create_bd_cell -type ip -vlnv xilinx.com:ip:axi_iic:2.0 sensor_iic_0
set_property -dict {CONFIG.IIC_FREQ_KHZ 400} [get_bd_cells sensor_iic_0]
create_bd_cell -type ip -vlnv xilinx.com:user:hdmi_hb:1.0 tx_hdmi_hb_0
create_bd_cell -type ip -vlnv xilinx.com:ip:v_multi_scaler:1.2 v_multi_scaler_0
set_property -dict [list \
  CONFIG.AXIMM_ADDR_WIDTH 64 \
  CONFIG.HAS_BGR8 1 \
  CONFIG.HAS_BGRX8 0 \
  CONFIG.HAS_RGBX8 0 \
  CONFIG.HAS_UYVY8 0 \
  CONFIG.HAS_Y8 0 \
  CONFIG.HAS_YUV8 0 \
  CONFIG.HAS_YUVX8 0 \
  CONFIG.HAS_YUYV8 0 \
  CONFIG.HAS_Y_UV8 1 \
  CONFIG.HAS_Y_UV8_420 1 \
  CONFIG.MAX_COLS 3840 \
  CONFIG.MAX_NR_PLANES 2 \
  CONFIG.MAX_OUTS 1 \
  CONFIG.MAX_ROWS 2160 \
] [get_bd_cells v_multi_scaler_0]
create_bd_cell -type ip -vlnv xilinx.com:ip:xlconstant:1.1 vcc_const
set_property -dict {CONFIG.CONST_VAL 1} [get_bd_cells vcc_const]
create_bd_cell -type ip -vlnv xilinx.com:ip:vcu:1.2 vcu_0
set_property -dict [list \
  CONFIG.ENC_BUFFER_B_FRAME 1 \
  CONFIG.ENC_BUFFER_EN true \
  CONFIG.ENC_BUFFER_MOTION_VEC_RANGE 1 \
  CONFIG.ENC_BUFFER_SIZE_ACTUAL 1445 \
  CONFIG.ENC_CODING_TYPE 1 \
  CONFIG.ENC_COLOR_DEPTH 0 \
  CONFIG.ENC_COLOR_FORMAT 0 \
  CONFIG.ENC_MEM_URAM_USED 1445 \
  CONFIG.TABLE_NO 2 \
] [get_bd_cells vcu_0]
create_bd_cell -type ip -vlnv xilinx.com:ip:vid_phy_controller:2.2 vid_phy_controller
set_property -dict [list \
  CONFIG.CHANNEL_ENABLE {X0Y0 X0Y1 X0Y2} \
  CONFIG.CHANNEL_SITE X0Y0 \
  CONFIG.C_FOR_UPGRADE_ARCHITECTURE placeholder \
  CONFIG.C_FOR_UPGRADE_DEVICE placeholder \
  CONFIG.C_FOR_UPGRADE_MAXOPTVOL 0.00 \
  CONFIG.C_FOR_UPGRADE_PACKAGE placeholder \
  CONFIG.C_FOR_UPGRADE_PART placeholder \
  CONFIG.C_FOR_UPGRADE_REFVOL 0.00 \
  CONFIG.C_FOR_UPGRADE_SPEEDGRADE 0 \
  CONFIG.C_INPUT_PIXELS_PER_CLOCK 2 \
  CONFIG.C_INT_HDMI_VER_CMPTBLE 3 \
  CONFIG.C_NIDRU true \
  CONFIG.C_NIDRU_REFCLK_SEL 5 \
  CONFIG.C_RX_PLL_SELECTION 0 \
  CONFIG.C_RX_REFCLK_SEL 1 \
  CONFIG.C_Rx_Protocol HDMI \
  CONFIG.C_TX_PLL_SELECTION 6 \
  CONFIG.C_TX_REFCLK_SEL 0 \
  CONFIG.C_Tx_Protocol HDMI \
  CONFIG.C_Txrefclk_Rdy_Invert true \
  CONFIG.C_Use_Oddr_for_Tmds_Clkout true \
  CONFIG.C_vid_phy_rx_axi4s_ch_INT_TDATA_WIDTH 20 \
  CONFIG.C_vid_phy_rx_axi4s_ch_TDATA_WIDTH 20 \
  CONFIG.C_vid_phy_rx_axi4s_ch_TUSER_WIDTH 1 \
  CONFIG.C_vid_phy_tx_axi4s_ch_INT_TDATA_WIDTH 20 \
  CONFIG.C_vid_phy_tx_axi4s_ch_TDATA_WIDTH 20 \
  CONFIG.C_vid_phy_tx_axi4s_ch_TUSER_WIDTH 1 \
  CONFIG.Rx_GT_Line_Rate 5.94 \
  CONFIG.Rx_GT_Ref_Clock_Freq 297 \
  CONFIG.Tx_GT_Line_Rate 5.94 \
  CONFIG.Tx_GT_Ref_Clock_Freq 297 \
] [get_bd_cells vid_phy_controller]
create_bd_cell -type ip -vlnv xilinx.com:ip:xlconcat:2.1 xlconcat_0
set_property -dict {CONFIG.NUM_PORTS 1} [get_bd_cells xlconcat_0]

# ---- hierarchy /gpio_aresetn ----
current_bd_instance /gpio_aresetn
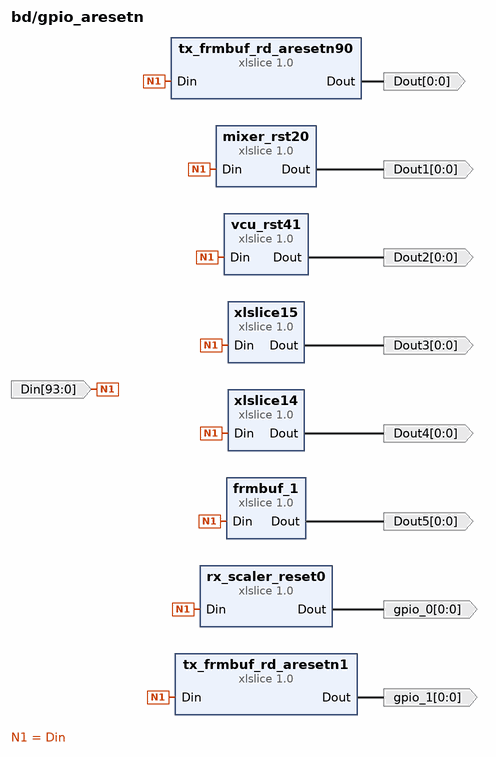
[diagram p3: block diagram inside /gpio_aresetn]
create_bd_pin -dir I -from 93 -to 0 Din
create_bd_pin -dir O -from 0 -to 0 Dout
create_bd_pin -dir O -from 0 -to 0 Dout1
create_bd_pin -dir O -from 0 -to 0 Dout2
create_bd_pin -dir O -from 0 -to 0 Dout3
create_bd_pin -dir O -from 0 -to 0 Dout4
create_bd_pin -dir O -from 0 -to 0 -type rst Dout5
create_bd_pin -dir O -from 0 -to 0 -type rst gpio_0
create_bd_pin -dir O -from 0 -to 0 gpio_1

create_bd_cell -type ip -vlnv xilinx.com:ip:xlslice:1.0 frmbuf_1
set_property -dict {CONFIG.DIN_FROM 16 CONFIG.DIN_TO 16 CONFIG.DIN_WIDTH 94 CONFIG.DOUT_WIDTH 1} [get_bd_cells frmbuf_1]
create_bd_cell -type ip -vlnv xilinx.com:ip:xlslice:1.0 mixer_rst20
set_property -dict {CONFIG.DIN_FROM 20 CONFIG.DIN_TO 20 CONFIG.DIN_WIDTH 94 CONFIG.DOUT_WIDTH 1} [get_bd_cells mixer_rst20]
create_bd_cell -type ip -vlnv xilinx.com:ip:xlslice:1.0 rx_scaler_reset0
set_property -dict {CONFIG.DIN_FROM 0 CONFIG.DIN_TO 0 CONFIG.DIN_WIDTH 94 CONFIG.DOUT_WIDTH 1} [get_bd_cells rx_scaler_reset0]
create_bd_cell -type ip -vlnv xilinx.com:ip:xlslice:1.0 tx_frmbuf_rd_aresetn1
set_property -dict [list \
  CONFIG.DIN_FROM 1 \
  CONFIG.DIN_TO 1 \
  CONFIG.DIN_WIDTH 94 \
  CONFIG.DOUT_WIDTH 1 \
] [get_bd_cells tx_frmbuf_rd_aresetn1]
create_bd_cell -type ip -vlnv xilinx.com:ip:xlslice:1.0 tx_frmbuf_rd_aresetn90
set_property -dict [list \
  CONFIG.DIN_FROM 90 \
  CONFIG.DIN_TO 90 \
  CONFIG.DIN_WIDTH 94 \
  CONFIG.DOUT_WIDTH 1 \
] [get_bd_cells tx_frmbuf_rd_aresetn90]
create_bd_cell -type ip -vlnv xilinx.com:ip:xlslice:1.0 vcu_rst41
set_property -dict {CONFIG.DIN_FROM 41 CONFIG.DIN_TO 41 CONFIG.DIN_WIDTH 94 CONFIG.DOUT_WIDTH 1} [get_bd_cells vcu_rst41]
create_bd_cell -type ip -vlnv xilinx.com:ip:xlslice:1.0 xlslice14
set_property -dict {CONFIG.DIN_FROM 14 CONFIG.DIN_TO 14 CONFIG.DIN_WIDTH 94 CONFIG.DOUT_WIDTH 1} [get_bd_cells xlslice14]
create_bd_cell -type ip -vlnv xilinx.com:ip:xlslice:1.0 xlslice15
set_property -dict {CONFIG.DIN_FROM 15 CONFIG.DIN_TO 15 CONFIG.DIN_WIDTH 94 CONFIG.DOUT_WIDTH 1} [get_bd_cells xlslice15]

# ---- hierarchy /gt_refclk_buf ----
current_bd_instance /gt_refclk_buf
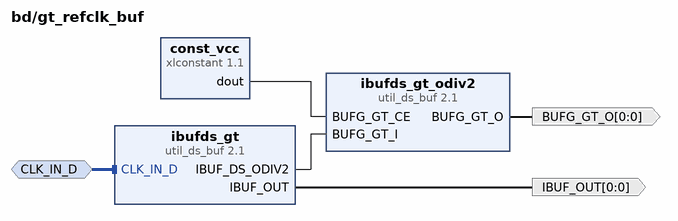
[diagram p4: block diagram inside /gt_refclk_buf]
create_bd_intf_pin -mode Slave -vlnv xilinx.com:interface:diff_clock_rtl:1.0 CLK_IN_D
create_bd_pin -dir O -from 0 -to 0 -type clk BUFG_GT_O
create_bd_pin -dir O -from 0 -to 0 -type clk IBUF_OUT

create_bd_cell -type ip -vlnv xilinx.com:ip:xlconstant:1.1 const_vcc
create_bd_cell -type ip -vlnv xilinx.com:ip:util_ds_buf:2.1 ibufds_gt
set_property -dict {CONFIG.C_BUF_TYPE IBUFDSGTE} [get_bd_cells ibufds_gt]
create_bd_cell -type ip -vlnv xilinx.com:ip:util_ds_buf:2.1 ibufds_gt_odiv2
set_property -dict {CONFIG.C_BUFGCE_DIV 2 CONFIG.C_BUF_TYPE BUFG_GT} [get_bd_cells ibufds_gt_odiv2]

# ---- hierarchy /hdmi_input ----
current_bd_instance /hdmi_input
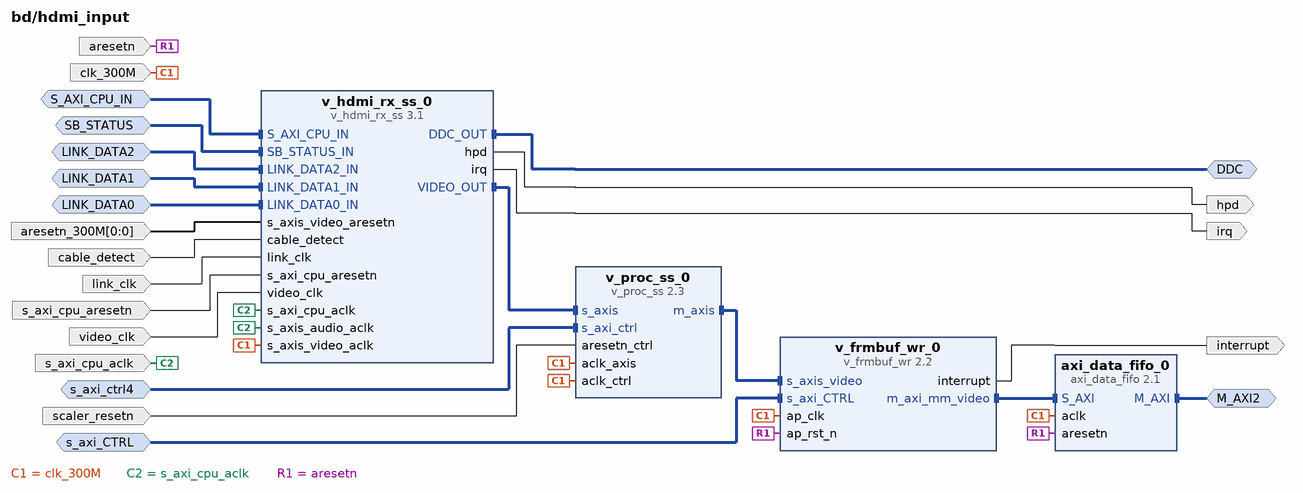
[diagram p5: block diagram inside /hdmi_input]
create_bd_intf_pin -mode Master -vlnv xilinx.com:interface:iic_rtl:1.0 DDC
create_bd_intf_pin -mode Slave -vlnv xilinx.com:interface:axis_rtl:1.0 LINK_DATA0
create_bd_intf_pin -mode Slave -vlnv xilinx.com:interface:axis_rtl:1.0 LINK_DATA1
create_bd_intf_pin -mode Slave -vlnv xilinx.com:interface:axis_rtl:1.0 LINK_DATA2
create_bd_intf_pin -mode Master -vlnv xilinx.com:interface:aximm_rtl:1.0 M_AXI2
create_bd_intf_pin -mode Slave -vlnv xilinx.com:interface:axis_rtl:1.0 SB_STATUS
create_bd_intf_pin -mode Slave -vlnv xilinx.com:interface:aximm_rtl:1.0 S_AXI_CPU_IN
create_bd_intf_pin -mode Slave -vlnv xilinx.com:interface:aximm_rtl:1.0 s_axi_CTRL
create_bd_intf_pin -mode Slave -vlnv xilinx.com:interface:aximm_rtl:1.0 s_axi_ctrl4
create_bd_pin -dir I -type rst aresetn
create_bd_pin -dir I -from 0 -to 0 -type rst aresetn_300M
create_bd_pin -dir I cable_detect
create_bd_pin -dir I -type clk clk_300M
create_bd_pin -dir O hpd
create_bd_pin -dir O -type intr interrupt
create_bd_pin -dir O -type intr irq
create_bd_pin -dir I -type clk link_clk
create_bd_pin -dir I -type clk s_axi_cpu_aclk
create_bd_pin -dir I -type rst s_axi_cpu_aresetn
create_bd_pin -dir I -type rst scaler_resetn
create_bd_pin -dir I -type clk video_clk

create_bd_cell -type ip -vlnv xilinx.com:ip:axi_data_fifo:2.1 axi_data_fifo_0
set_property -dict {CONFIG.WRITE_FIFO_DELAY 1 CONFIG.WRITE_FIFO_DEPTH 512} [get_bd_cells axi_data_fifo_0]
create_bd_cell -type ip -vlnv xilinx.com:ip:v_frmbuf_wr:2.2 v_frmbuf_wr_0
set_property -dict [list \
  CONFIG.AXIMM_ADDR_WIDTH 64 \
  CONFIG.AXIMM_DATA_WIDTH 128 \
  CONFIG.C_M_AXI_MM_VIDEO_DATA_WIDTH 128 \
  CONFIG.HAS_BGRX8 0 \
  CONFIG.HAS_RGB8 1 \
  CONFIG.HAS_RGBX8 0 \
  CONFIG.HAS_UYVY8 0 \
  CONFIG.HAS_Y8 0 \
  CONFIG.HAS_YUV8 0 \
  CONFIG.HAS_YUVX8 0 \
  CONFIG.HAS_YUYV8 0 \
  CONFIG.HAS_Y_UV8 1 \
  CONFIG.HAS_Y_UV8_420 1 \
  CONFIG.MAX_DATA_WIDTH 8 \
  CONFIG.MAX_NR_PLANES 2 \
  CONFIG.SAMPLES_PER_CLOCK 2 \
] [get_bd_cells v_frmbuf_wr_0]
create_bd_cell -type ip -vlnv xilinx.com:ip:v_hdmi_rx_ss:3.1 v_hdmi_rx_ss_0
set_property -dict [list \
  CONFIG.C_CD_INVERT true \
  CONFIG.C_HDMI_FAST_SWITCH true \
  CONFIG.C_INCLUDE_YUV420_SUP true \
  CONFIG.C_INPUT_PIXELS_PER_CLOCK 2 \
  CONFIG.C_MAX_BITS_PER_COMPONENT 8 \
] [get_bd_cells v_hdmi_rx_ss_0]
create_bd_cell -type ip -vlnv xilinx.com:ip:v_proc_ss:2.3 v_proc_ss_0
set_property -dict [list \
  CONFIG.C_ENABLE_CSC true \
  CONFIG.C_H_SCALER_TAPS 6 \
  CONFIG.C_MAX_DATA_WIDTH 8 \
  CONFIG.C_TOPOLOGY 0 \
  CONFIG.C_V_SCALER_TAPS 6 \
] [get_bd_cells v_proc_ss_0]

# ---- hierarchy /hdmi_output ----
current_bd_instance /hdmi_output
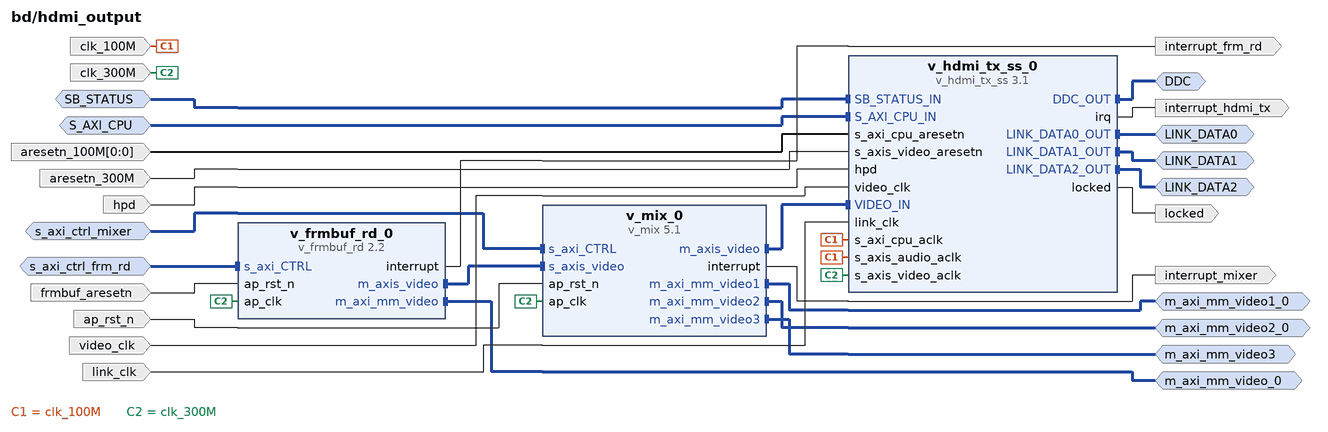
[diagram p6: block diagram inside /hdmi_output]
create_bd_intf_pin -mode Master -vlnv xilinx.com:interface:iic_rtl:1.0 DDC
create_bd_intf_pin -mode Master -vlnv xilinx.com:interface:axis_rtl:1.0 LINK_DATA0
create_bd_intf_pin -mode Master -vlnv xilinx.com:interface:axis_rtl:1.0 LINK_DATA1
create_bd_intf_pin -mode Master -vlnv xilinx.com:interface:axis_rtl:1.0 LINK_DATA2
create_bd_intf_pin -mode Slave -vlnv xilinx.com:interface:axis_rtl:1.0 SB_STATUS
create_bd_intf_pin -mode Slave -vlnv xilinx.com:interface:aximm_rtl:1.0 S_AXI_CPU
create_bd_intf_pin -mode Master -vlnv xilinx.com:interface:aximm_rtl:1.0 m_axi_mm_video1_0
create_bd_intf_pin -mode Master -vlnv xilinx.com:interface:aximm_rtl:1.0 m_axi_mm_video2_0
create_bd_intf_pin -mode Master -vlnv xilinx.com:interface:aximm_rtl:1.0 m_axi_mm_video3
create_bd_intf_pin -mode Master -vlnv xilinx.com:interface:aximm_rtl:1.0 m_axi_mm_video_0
create_bd_intf_pin -mode Slave -vlnv xilinx.com:interface:aximm_rtl:1.0 s_axi_ctrl_frm_rd
create_bd_intf_pin -mode Slave -vlnv xilinx.com:interface:aximm_rtl:1.0 s_axi_ctrl_mixer
create_bd_pin -dir I -type rst ap_rst_n
create_bd_pin -dir I -from 0 -to 0 -type rst aresetn_100M
create_bd_pin -dir I -type rst aresetn_300M
create_bd_pin -dir I -type clk clk_100M
create_bd_pin -dir I -type clk clk_300M
create_bd_pin -dir I -type rst frmbuf_aresetn
create_bd_pin -dir I hpd
create_bd_pin -dir O -type intr interrupt_frm_rd
create_bd_pin -dir O -type intr interrupt_hdmi_tx
create_bd_pin -dir O -type intr interrupt_mixer
create_bd_pin -dir I -type clk link_clk
create_bd_pin -dir O locked
create_bd_pin -dir I -type clk video_clk

create_bd_cell -type ip -vlnv xilinx.com:ip:v_frmbuf_rd:2.2 v_frmbuf_rd_0
set_property -dict [list \
  CONFIG.AXIMM_ADDR_WIDTH 64 \
  CONFIG.HAS_BGRX8 0 \
  CONFIG.HAS_RGBX8 0 \
  CONFIG.HAS_UYVY8 0 \
  CONFIG.HAS_Y8 0 \
  CONFIG.HAS_YUV8 0 \
  CONFIG.HAS_YUVX8 0 \
  CONFIG.HAS_YUYV8 0 \
  CONFIG.HAS_Y_UV8 1 \
  CONFIG.HAS_Y_UV8_420 1 \
  CONFIG.MAX_DATA_WIDTH 8 \
  CONFIG.MAX_NR_PLANES 2 \
] [get_bd_cells v_frmbuf_rd_0]
create_bd_cell -type ip -vlnv xilinx.com:ip:v_hdmi_tx_ss:3.1 v_hdmi_tx_ss_0
set_property -dict [list \
  CONFIG.C_HDMI_FAST_SWITCH true \
  CONFIG.C_INCLUDE_YUV420_SUP true \
  CONFIG.C_INPUT_PIXELS_PER_CLOCK 2 \
  CONFIG.C_MAX_BITS_PER_COMPONENT 8 \
  CONFIG.C_VID_INTERFACE 0 \
] [get_bd_cells v_hdmi_tx_ss_0]
create_bd_cell -type ip -vlnv xilinx.com:ip:v_mix:5.1 v_mix_0
set_property -dict [list \
  CONFIG.AXIMM_ADDR_WIDTH 64 \
  CONFIG.AXIMM_DATA_WIDTH 128 \
  CONFIG.AXIMM_NUM_OUTSTANDING 16 \
  CONFIG.C_M_AXI_MM_VIDEO1_DATA_WIDTH 128 \
  CONFIG.C_M_AXI_MM_VIDEO2_DATA_WIDTH 128 \
  CONFIG.C_M_AXI_MM_VIDEO3_DATA_WIDTH 128 \
  CONFIG.C_M_AXI_MM_VIDEO_ENABLE_USER_PORTS true \
  CONFIG.LAYER1_VIDEO_FORMAT 19 \
  CONFIG.LAYER2_VIDEO_FORMAT 19 \
  CONFIG.LAYER3_VIDEO_FORMAT 26 \
  CONFIG.LAYER4_VIDEO_FORMAT 19 \
  CONFIG.LAYER5_VIDEO_FORMAT 19 \
  CONFIG.LAYER6_VIDEO_FORMAT 19 \
  CONFIG.LAYER7_ALPHA false \
  CONFIG.LAYER7_VIDEO_FORMAT 19 \
  CONFIG.LAYER8_ALPHA false \
  CONFIG.LAYER8_VIDEO_FORMAT 19 \
  CONFIG.MAX_DATA_WIDTH 8 \
  CONFIG.NR_LAYERS 4 \
  CONFIG.SAMPLES_PER_CLOCK 2 \
] [get_bd_cells v_mix_0]

# ---- connections ----

current_bd_instance /gpio_aresetn
connect_bd_net [get_bd_pins frmbuf_1/Dout] [get_bd_pins Dout5]
connect_bd_net -net frmbuf_rd_rst_gpio_Dout [get_bd_pins tx_frmbuf_rd_aresetn1/Dout] [get_bd_pins gpio_1]
connect_bd_net -net frmbuf_wr_rst_gpio_Dout [get_bd_pins rx_scaler_reset0/Dout] [get_bd_pins gpio_0]
connect_bd_net -net mixer_rst_Dout [get_bd_pins mixer_rst20/Dout] [get_bd_pins Dout1]
connect_bd_net -net tx_frmbuf_rd_aresetn_2_Dout [get_bd_pins tx_frmbuf_rd_aresetn90/Dout] [get_bd_pins Dout]
connect_bd_net -net vcu_rst_Dout [get_bd_pins vcu_rst41/Dout] [get_bd_pins Dout2]
connect_bd_net -net xlslice_1_Dout [get_bd_pins xlslice15/Dout] [get_bd_pins Dout3]
connect_bd_net -net xlslice_2_Dout [get_bd_pins xlslice14/Dout] [get_bd_pins Dout4]
connect_bd_net -net zynq_ultra_ps_e_0_emio_gpio_o [get_bd_pins Din] \
  [get_bd_pins frmbuf_1/Din] [get_bd_pins mixer_rst20/Din] [get_bd_pins rx_scaler_reset0/Din] \
  [get_bd_pins tx_frmbuf_rd_aresetn1/Din] [get_bd_pins tx_frmbuf_rd_aresetn90/Din] [get_bd_pins vcu_rst41/Din] \
  [get_bd_pins xlslice14/Din] [get_bd_pins xlslice15/Din]

current_bd_instance /gt_refclk_buf
connect_bd_intf_net -intf_net DRU_CLK_IN_1 [get_bd_intf_pins CLK_IN_D] [get_bd_intf_pins ibufds_gt/CLK_IN_D]
connect_bd_net [get_bd_pins const_vcc/dout] [get_bd_pins ibufds_gt_odiv2/BUFG_GT_CE]
connect_bd_net [get_bd_pins ibufds_gt/IBUF_DS_ODIV2] [get_bd_pins ibufds_gt_odiv2/BUFG_GT_I]
connect_bd_net [get_bd_pins ibufds_gt/IBUF_OUT] [get_bd_pins IBUF_OUT]
connect_bd_net [get_bd_pins ibufds_gt_odiv2/BUFG_GT_O] [get_bd_pins BUFG_GT_O]

current_bd_instance /hdmi_input
connect_bd_intf_net [get_bd_intf_pins s_axi_CTRL] [get_bd_intf_pins v_frmbuf_wr_0/s_axi_CTRL]
connect_bd_intf_net [get_bd_intf_pins S_AXI_CPU_IN] [get_bd_intf_pins v_hdmi_rx_ss_0/S_AXI_CPU_IN]
connect_bd_intf_net [get_bd_intf_pins s_axi_ctrl4] [get_bd_intf_pins v_proc_ss_0/s_axi_ctrl]
connect_bd_intf_net [get_bd_intf_pins v_frmbuf_wr_0/s_axis_video] [get_bd_intf_pins v_proc_ss_0/m_axis]
connect_bd_intf_net [get_bd_intf_pins v_hdmi_rx_ss_0/VIDEO_OUT] [get_bd_intf_pins v_proc_ss_0/s_axis]
connect_bd_intf_net [get_bd_intf_pins axi_data_fifo_0/S_AXI] [get_bd_intf_pins v_frmbuf_wr_0/m_axi_mm_video]
connect_bd_intf_net [get_bd_intf_pins SB_STATUS] [get_bd_intf_pins v_hdmi_rx_ss_0/SB_STATUS_IN]
connect_bd_intf_net [get_bd_intf_pins LINK_DATA2] [get_bd_intf_pins v_hdmi_rx_ss_0/LINK_DATA2_IN]
connect_bd_intf_net [get_bd_intf_pins LINK_DATA1] [get_bd_intf_pins v_hdmi_rx_ss_0/LINK_DATA1_IN]
connect_bd_intf_net [get_bd_intf_pins LINK_DATA0] [get_bd_intf_pins v_hdmi_rx_ss_0/LINK_DATA0_IN]
connect_bd_intf_net [get_bd_intf_pins M_AXI2] [get_bd_intf_pins axi_data_fifo_0/M_AXI]
connect_bd_intf_net [get_bd_intf_pins DDC] [get_bd_intf_pins v_hdmi_rx_ss_0/DDC_OUT]
connect_bd_net [get_bd_pins aresetn_300M] [get_bd_pins v_hdmi_rx_ss_0/s_axis_video_aresetn]
connect_bd_net [get_bd_pins cable_detect] [get_bd_pins v_hdmi_rx_ss_0/cable_detect]
connect_bd_net [get_bd_pins clk_300M] \
  [get_bd_pins axi_data_fifo_0/aclk] [get_bd_pins v_frmbuf_wr_0/ap_clk] [get_bd_pins v_hdmi_rx_ss_0/s_axis_video_aclk] \
  [get_bd_pins v_proc_ss_0/aclk_axis] [get_bd_pins v_proc_ss_0/aclk_ctrl]
connect_bd_net [get_bd_pins link_clk] [get_bd_pins v_hdmi_rx_ss_0/link_clk]
connect_bd_net -net mpsoc_ss_aresetn_100M [get_bd_pins s_axi_cpu_aresetn] [get_bd_pins v_hdmi_rx_ss_0/s_axi_cpu_aresetn]
connect_bd_net -net mpsoc_ss_clk_100M [get_bd_pins s_axi_cpu_aclk] \
  [get_bd_pins v_hdmi_rx_ss_0/s_axi_cpu_aclk] [get_bd_pins v_hdmi_rx_ss_0/s_axis_audio_aclk]
connect_bd_net -net rx_scaler_reset [get_bd_pins scaler_resetn] [get_bd_pins v_proc_ss_0/aresetn_ctrl]
connect_bd_net [get_bd_pins v_frmbuf_wr_0/interrupt] [get_bd_pins interrupt]
connect_bd_net [get_bd_pins v_hdmi_rx_ss_0/hpd] [get_bd_pins hpd]
connect_bd_net [get_bd_pins v_hdmi_rx_ss_0/irq] [get_bd_pins irq]
connect_bd_net [get_bd_pins video_clk] [get_bd_pins v_hdmi_rx_ss_0/video_clk]
connect_bd_net -net xlslice_1_Dout [get_bd_pins aresetn] [get_bd_pins axi_data_fifo_0/aresetn] [get_bd_pins v_frmbuf_wr_0/ap_rst_n]

current_bd_instance /hdmi_output
connect_bd_intf_net [get_bd_intf_pins s_axi_ctrl_mixer] [get_bd_intf_pins v_mix_0/s_axi_CTRL]
connect_bd_intf_net [get_bd_intf_pins m_axi_mm_video1_0] [get_bd_intf_pins v_mix_0/m_axi_mm_video1]
connect_bd_intf_net [get_bd_intf_pins m_axi_mm_video2_0] [get_bd_intf_pins v_mix_0/m_axi_mm_video2]
connect_bd_intf_net [get_bd_intf_pins m_axi_mm_video3] [get_bd_intf_pins v_mix_0/m_axi_mm_video3]
connect_bd_intf_net [get_bd_intf_pins m_axi_mm_video_0] [get_bd_intf_pins v_frmbuf_rd_0/m_axi_mm_video]
connect_bd_intf_net [get_bd_intf_pins DDC] [get_bd_intf_pins v_hdmi_tx_ss_0/DDC_OUT]
connect_bd_intf_net [get_bd_intf_pins LINK_DATA0] [get_bd_intf_pins v_hdmi_tx_ss_0/LINK_DATA0_OUT]
connect_bd_intf_net [get_bd_intf_pins LINK_DATA1] [get_bd_intf_pins v_hdmi_tx_ss_0/LINK_DATA1_OUT]
connect_bd_intf_net [get_bd_intf_pins LINK_DATA2] [get_bd_intf_pins v_hdmi_tx_ss_0/LINK_DATA2_OUT]
connect_bd_intf_net [get_bd_intf_pins SB_STATUS] [get_bd_intf_pins v_hdmi_tx_ss_0/SB_STATUS_IN]
connect_bd_intf_net [get_bd_intf_pins S_AXI_CPU] [get_bd_intf_pins v_hdmi_tx_ss_0/S_AXI_CPU_IN]
connect_bd_intf_net [get_bd_intf_pins s_axi_ctrl_frm_rd] [get_bd_intf_pins v_frmbuf_rd_0/s_axi_CTRL]
connect_bd_intf_net [get_bd_intf_pins v_frmbuf_rd_0/m_axis_video] [get_bd_intf_pins v_mix_0/s_axis_video]
connect_bd_intf_net [get_bd_intf_pins v_hdmi_tx_ss_0/VIDEO_IN] [get_bd_intf_pins v_mix_0/m_axis_video]
connect_bd_net [get_bd_pins ap_rst_n] [get_bd_pins v_mix_0/ap_rst_n]
connect_bd_net [get_bd_pins aresetn_100M] [get_bd_pins v_hdmi_tx_ss_0/s_axi_cpu_aresetn]
connect_bd_net [get_bd_pins aresetn_300M] [get_bd_pins v_hdmi_tx_ss_0/s_axis_video_aresetn]
connect_bd_net [get_bd_pins clk_100M] [get_bd_pins v_hdmi_tx_ss_0/s_axi_cpu_aclk] [get_bd_pins v_hdmi_tx_ss_0/s_axis_audio_aclk]
connect_bd_net [get_bd_pins clk_300M] [get_bd_pins v_frmbuf_rd_0/ap_clk] [get_bd_pins v_hdmi_tx_ss_0/s_axis_video_aclk] [get_bd_pins v_mix_0/ap_clk]
connect_bd_net [get_bd_pins frmbuf_aresetn] [get_bd_pins v_frmbuf_rd_0/ap_rst_n]
connect_bd_net [get_bd_pins hpd] [get_bd_pins v_hdmi_tx_ss_0/hpd]
connect_bd_net [get_bd_pins v_frmbuf_rd_0/interrupt] [get_bd_pins interrupt_frm_rd]
connect_bd_net [get_bd_pins v_hdmi_tx_ss_0/irq] [get_bd_pins interrupt_hdmi_tx]
connect_bd_net [get_bd_pins v_hdmi_tx_ss_0/locked] [get_bd_pins locked]
connect_bd_net [get_bd_pins v_mix_0/interrupt] [get_bd_pins interrupt_mixer]
connect_bd_net -net vid_phy_controller_0_tx_video_clk [get_bd_pins video_clk] [get_bd_pins v_hdmi_tx_ss_0/video_clk]
connect_bd_net -net vid_phy_controller_0_txoutclk [get_bd_pins link_clk] [get_bd_pins v_hdmi_tx_ss_0/link_clk]

current_bd_instance /
connect_bd_intf_net [get_bd_intf_pins axi_interconnect_4/M00_AXI] [get_bd_intf_pins ps_e/S_AXI_HP2_FPD]
connect_bd_intf_net [get_bd_intf_pins axi_interconnect_5/M00_AXI] [get_bd_intf_pins ps_e/S_AXI_HPC0_FPD]
connect_bd_intf_net [get_bd_intf_pins axi_interconnect_6/M00_AXI] [get_bd_intf_pins ps_e/S_AXI_HP3_FPD]
connect_bd_intf_net [get_bd_intf_pins hdmi_output/LINK_DATA1] [get_bd_intf_pins vid_phy_controller/vid_phy_tx_axi4s_ch1]
connect_bd_intf_net -intf_net mpsoc_ss_M18_AXI_0 [get_bd_intf_pins axi_interconnect/M10_AXI] [get_bd_intf_pins sensor_iic_0/S_AXI]
connect_bd_intf_net -intf_net mpsoc_ss_M11_AXI [get_bd_intf_pins axi_intc_1/s_axi] [get_bd_intf_pins axi_interconnect/M11_AXI]
connect_bd_intf_net -intf_net mpsoc_ss_M09_AXI_0 [get_bd_intf_pins axi_interconnect/M09_AXI] [get_bd_intf_pins v_multi_scaler_0/s_axi_CTRL]
connect_bd_intf_net -intf_net axi_interconnect_0_M00_AXI [get_bd_intf_pins axi_intc_0/s_axi] [get_bd_intf_pins interconnect_axilite/M00_AXI]
connect_bd_intf_net [get_bd_intf_ports TX_DDC] [get_bd_intf_pins hdmi_output/DDC]
connect_bd_intf_net [get_bd_intf_pins axi_interconnect/M02_AXI] [get_bd_intf_pins hdmi_output/S_AXI_CPU]
connect_bd_intf_net -intf_net SB_STATUS_IN_1 [get_bd_intf_pins hdmi_output/SB_STATUS] [get_bd_intf_pins vid_phy_controller/vid_phy_status_sb_tx]
connect_bd_intf_net [get_bd_intf_pins hdmi_output/SB_STATUS] [get_bd_intf_pins tx_hdmi_hb_0/status_sb]
connect_bd_intf_net [get_bd_intf_pins axi_interconnect_4/S04_AXI] [get_bd_intf_pins hdmi_output/m_axi_mm_video3]
connect_bd_intf_net [get_bd_intf_pins axi_interconnect_4/S00_AXI] [get_bd_intf_pins v_multi_scaler_0/m_axi_mm_video]
connect_bd_intf_net [get_bd_intf_pins axi_interconnect_6/S02_AXI] [get_bd_intf_pins vcu_0/M_AXI_DEC0]
connect_bd_intf_net [get_bd_intf_pins axi_interconnect_6/S03_AXI] [get_bd_intf_pins vcu_0/M_AXI_DEC1]
connect_bd_intf_net [get_bd_intf_pins axi_interconnect_6/S00_AXI] [get_bd_intf_pins vcu_0/M_AXI_ENC0]
connect_bd_intf_net [get_bd_intf_pins axi_interconnect_6/S01_AXI] [get_bd_intf_pins vcu_0/M_AXI_ENC1]
connect_bd_intf_net [get_bd_intf_pins axi_interconnect_5/S00_AXI] [get_bd_intf_pins vcu_0/M_AXI_MCU]
connect_bd_intf_net [get_bd_intf_pins hdmi_input/LINK_DATA0] [get_bd_intf_pins vid_phy_controller/vid_phy_rx_axi4s_ch0]
connect_bd_intf_net [get_bd_intf_pins hdmi_input/LINK_DATA1] [get_bd_intf_pins vid_phy_controller/vid_phy_rx_axi4s_ch1]
connect_bd_intf_net [get_bd_intf_pins hdmi_input/LINK_DATA2] [get_bd_intf_pins vid_phy_controller/vid_phy_rx_axi4s_ch2]
connect_bd_intf_net [get_bd_intf_pins hdmi_input/SB_STATUS] [get_bd_intf_pins vid_phy_controller/vid_phy_status_sb_rx]
connect_bd_intf_net [get_bd_intf_pins hdmi_input/SB_STATUS] [get_bd_intf_pins rx_hdmi_hb_0/status_sb]
connect_bd_intf_net -intf_net CLK_IN1_D_0_2 [get_bd_intf_ports si570_user] [get_bd_intf_pins clk_wiz_1/CLK_IN1_D]
connect_bd_intf_net [get_bd_intf_ports RX_DDC] [get_bd_intf_pins hdmi_input/DDC]
connect_bd_intf_net -intf_net mpsoc_ss_M00_AXI [get_bd_intf_pins axi_interconnect/M00_AXI] [get_bd_intf_pins vid_phy_controller/vid_phy_axi4lite]
connect_bd_intf_net -intf_net mpsoc_ss_M01_AXI [get_bd_intf_pins axi_interconnect/M01_AXI] [get_bd_intf_pins hdmi_input/S_AXI_CPU_IN]
connect_bd_intf_net [get_bd_intf_pins axi_interconnect_4/S03_AXI] [get_bd_intf_pins hdmi_output/m_axi_mm_video2_0]
connect_bd_intf_net [get_bd_intf_pins axi_interconnect_8/M00_AXI] [get_bd_intf_pins ps_e/S_AXI_HP1_FPD]
connect_bd_intf_net [get_bd_intf_pins axi_interconnect_lpd/M00_AXI] [get_bd_intf_pins ps_e/S_AXI_LPD]
connect_bd_intf_net [get_bd_intf_pins axi_interconnect_lpd/S00_AXI] [get_bd_intf_pins axi_vip_1/M_AXI]
connect_bd_intf_net [get_bd_intf_pins axi_interconnect_8/S00_AXI] [get_bd_intf_pins hdmi_input/M_AXI2]
connect_bd_intf_net [get_bd_intf_pins hdmi_output/LINK_DATA0] [get_bd_intf_pins vid_phy_controller/vid_phy_tx_axi4s_ch0]
connect_bd_intf_net [get_bd_intf_ports DRU_CLK] [get_bd_intf_pins gt_refclk_buf/CLK_IN_D]
connect_bd_intf_net -intf_net mpsoc_ss_IIC [get_bd_intf_ports HDMI_CTRL_IIC] [get_bd_intf_pins hdmi_ctrl_iic/IIC]
connect_bd_intf_net -intf_net ps_e_0_M_AXI_HPM0_LPD [get_bd_intf_pins interconnect_axilite/S00_AXI] [get_bd_intf_pins ps_e/M_AXI_HPM0_LPD]
connect_bd_intf_net [get_bd_intf_pins axi_interconnect/S00_AXI] [get_bd_intf_pins ps_e/M_AXI_HPM0_FPD]
connect_bd_intf_net [get_bd_intf_ports sensor_iic] [get_bd_intf_pins sensor_iic_0/IIC]
connect_bd_intf_net [get_bd_intf_pins axi_interconnect/M05_AXI] [get_bd_intf_pins hdmi_output/s_axi_ctrl_frm_rd]
connect_bd_intf_net [get_bd_intf_pins interconnect_axihpm0fpd/S00_AXI] [get_bd_intf_pins ps_e/M_AXI_HPM1_FPD]
connect_bd_intf_net [get_bd_intf_pins axi_interconnect/M07_AXI] [get_bd_intf_pins hdmi_output/s_axi_ctrl_mixer]
connect_bd_intf_net [get_bd_intf_pins axi_interconnect_4/S02_AXI] [get_bd_intf_pins hdmi_output/m_axi_mm_video1_0]
connect_bd_intf_net [get_bd_intf_pins hdmi_output/LINK_DATA2] [get_bd_intf_pins vid_phy_controller/vid_phy_tx_axi4s_ch2]
connect_bd_intf_net [get_bd_intf_pins axi_register_slice_0/S_AXI] [get_bd_intf_pins interconnect_axihpm0fpd/M00_AXI]
connect_bd_intf_net -intf_net mpsoc_ss_M08_AXI_0 [get_bd_intf_pins axi_interconnect/M08_AXI] [get_bd_intf_pins vcu_0/S_AXI_LITE]
connect_bd_intf_net -intf_net intf_net_axi_interconnect_M04_AXI [get_bd_intf_pins axi_interconnect/M04_AXI] [get_bd_intf_pins hdmi_ctrl_iic/S_AXI]
connect_bd_intf_net -intf_net mpsoc_ss_M03_AXI [get_bd_intf_pins axi_interconnect/M03_AXI] [get_bd_intf_pins hdmi_input/s_axi_CTRL]
connect_bd_intf_net -intf_net mpsoc_ss_M06_AXI [get_bd_intf_pins axi_interconnect/M06_AXI] [get_bd_intf_pins hdmi_input/s_axi_ctrl4]
connect_bd_intf_net [get_bd_intf_pins axi_interconnect_4/S01_AXI] [get_bd_intf_pins hdmi_output/m_axi_mm_video_0]
connect_bd_net -net ARESETN_2 [get_bd_pins proc_sys_reset_7/interconnect_aresetn] [get_bd_pins axi_interconnect/ARESETN]
connect_bd_net [get_bd_ports HDMI_RX_CLK_N] [get_bd_pins vid_phy_controller/mgtrefclk1_pad_n_in]
connect_bd_net [get_bd_ports HDMI_RX_CLK_P] [get_bd_pins vid_phy_controller/mgtrefclk1_pad_p_in]
connect_bd_net [get_bd_ports HDMI_RX_DAT_N] [get_bd_pins vid_phy_controller/phy_rxn_in]
connect_bd_net [get_bd_ports HDMI_RX_DAT_P] [get_bd_pins vid_phy_controller/phy_rxp_in]
connect_bd_net -net HDMI_TX_CLK_N [get_bd_pins vid_phy_controller/tx_tmds_clk_n] [get_bd_ports HDMI_TX_CLK_N]
connect_bd_net -net HDMI_TX_CLK_P [get_bd_pins vid_phy_controller/tx_tmds_clk_p] [get_bd_ports HDMI_TX_CLK_P]
connect_bd_net -net HDMI_TX_DAT_N [get_bd_pins vid_phy_controller/phy_txn_out] [get_bd_ports HDMI_TX_DAT_N]
connect_bd_net -net HDMI_TX_DAT_P [get_bd_pins vid_phy_controller/phy_txp_out] [get_bd_ports HDMI_TX_DAT_P]
connect_bd_net -net LED0 [get_bd_pins hdmi_output/locked] [get_bd_ports LED0]
connect_bd_net -net LED6 [get_bd_pins tx_hdmi_hb_0/hdmi_hb] [get_bd_ports LED6]
connect_bd_net -net LED7 [get_bd_pins rx_hdmi_hb_0/hdmi_hb] [get_bd_ports LED7]
connect_bd_net [get_bd_pins ps_e/pl_resetn0] \
  [get_bd_pins clk_wiz_0/resetn] [get_bd_pins proc_sys_reset_0/ext_reset_in] [get_bd_pins proc_sys_reset_1/ext_reset_in] \
  [get_bd_pins proc_sys_reset_2/ext_reset_in] [get_bd_pins proc_sys_reset_3/ext_reset_in] \
  [get_bd_pins proc_sys_reset_4/ext_reset_in] [get_bd_pins proc_sys_reset_5/ext_reset_in] \
  [get_bd_pins proc_sys_reset_6/ext_reset_in]
connect_bd_net [get_bd_pins clk_wiz_1/clk_out2] \
  [get_bd_pins axi_interconnect/M03_ACLK] [get_bd_pins axi_interconnect/M05_ACLK] [get_bd_pins axi_interconnect/M06_ACLK] \
  [get_bd_pins axi_interconnect/M07_ACLK] [get_bd_pins axi_interconnect/M09_ACLK] [get_bd_pins axi_interconnect/M12_ACLK] \
  [get_bd_pins axi_interconnect_4/ACLK] [get_bd_pins axi_interconnect_4/M00_ACLK] [get_bd_pins axi_interconnect_4/S00_ACLK] \
  [get_bd_pins axi_interconnect_4/S01_ACLK] [get_bd_pins axi_interconnect_4/S02_ACLK] \
  [get_bd_pins axi_interconnect_4/S03_ACLK] [get_bd_pins axi_interconnect_4/S04_ACLK] [get_bd_pins axi_interconnect_5/ACLK] \
  [get_bd_pins axi_interconnect_5/M00_ACLK] [get_bd_pins axi_interconnect_5/S00_ACLK] [get_bd_pins axi_interconnect_6/ACLK] \
  [get_bd_pins axi_interconnect_6/M00_ACLK] [get_bd_pins axi_interconnect_6/S00_ACLK] \
  [get_bd_pins axi_interconnect_6/S01_ACLK] [get_bd_pins axi_interconnect_6/S02_ACLK] \
  [get_bd_pins axi_interconnect_6/S03_ACLK] [get_bd_pins axi_interconnect_8/ACLK] [get_bd_pins axi_interconnect_8/M00_ACLK] \
  [get_bd_pins axi_interconnect_8/S00_ACLK] [get_bd_pins hdmi_input/clk_300M] [get_bd_pins hdmi_output/clk_300M] \
  [get_bd_pins proc_sys_reset_8/slowest_sync_clk] [get_bd_pins ps_e/saxihp1_fpd_aclk] [get_bd_pins ps_e/saxihp2_fpd_aclk] \
  [get_bd_pins ps_e/saxihp3_fpd_aclk] [get_bd_pins ps_e/saxihpc0_fpd_aclk] [get_bd_pins v_multi_scaler_0/ap_clk] \
  [get_bd_pins vcu_0/m_axi_dec_aclk] [get_bd_pins vcu_0/m_axi_enc_aclk] [get_bd_pins vcu_0/m_axi_mcu_aclk]
connect_bd_net [get_bd_ports RX_DET] [get_bd_pins hdmi_input/cable_detect]
connect_bd_net -net RX_HPD [get_bd_pins hdmi_input/hpd] [get_bd_ports RX_HPD]
connect_bd_net -net RX_REFCLK_N [get_bd_pins vid_phy_controller/rx_tmds_clk_n] [get_bd_ports RX_REFCLK_N]
connect_bd_net -net RX_REFCLK_P [get_bd_pins vid_phy_controller/rx_tmds_clk_p] [get_bd_ports RX_REFCLK_P]
connect_bd_net [get_bd_ports SI5319_LOL] [get_bd_pins vid_phy_controller/tx_refclk_rdy]
connect_bd_net [get_bd_ports TX_HPD] [get_bd_pins hdmi_output/hpd]
connect_bd_net [get_bd_ports TX_REFCLK_N] [get_bd_pins vid_phy_controller/mgtrefclk0_pad_n_in]
connect_bd_net [get_bd_ports TX_REFCLK_P] [get_bd_pins vid_phy_controller/mgtrefclk0_pad_p_in]
connect_bd_net -net ap_rst_n_1 [get_bd_pins gpio_aresetn/Dout1] [get_bd_pins hdmi_output/ap_rst_n]
connect_bd_net -net aresetn_1 [get_bd_pins gpio_aresetn/Dout3] [get_bd_pins hdmi_input/aresetn]
connect_bd_net -net aresetn_100M [get_bd_pins proc_sys_reset_7/peripheral_aresetn] \
  [get_bd_ports SI5319_RST] [get_bd_pins axi_intc_1/s_axi_aresetn] [get_bd_pins axi_interconnect/M00_ARESETN] \
  [get_bd_pins axi_interconnect/M01_ARESETN] [get_bd_pins axi_interconnect/M02_ARESETN] \
  [get_bd_pins axi_interconnect/M04_ARESETN] [get_bd_pins axi_interconnect/M08_ARESETN] \
  [get_bd_pins axi_interconnect/M10_ARESETN] [get_bd_pins axi_interconnect/M11_ARESETN] \
  [get_bd_pins axi_interconnect/S00_ARESETN] [get_bd_pins hdmi_ctrl_iic/s_axi_aresetn] \
  [get_bd_pins hdmi_input/s_axi_cpu_aresetn] [get_bd_pins hdmi_output/aresetn_100M] [get_bd_pins sensor_iic_0/s_axi_aresetn] \
  [get_bd_pins vid_phy_controller/vid_phy_axi4lite_aresetn] [get_bd_pins vid_phy_controller/vid_phy_sb_aresetn]
connect_bd_net [get_bd_pins axi_intc_0/irq] [get_bd_pins ps_e/pl_ps_irq0]
connect_bd_net [get_bd_pins axi_intc_1/irq] [get_bd_pins xlconcat_0/In0]
connect_bd_net [get_bd_pins clk_wiz_0/clk_out2] \
  [get_bd_pins axi_interconnect_lpd/ACLK] [get_bd_pins axi_interconnect_lpd/M00_ACLK] \
  [get_bd_pins axi_interconnect_lpd/S00_ACLK] [get_bd_pins axi_register_slice_0/aclk] [get_bd_pins axi_vip_1/aclk] \
  [get_bd_pins interconnect_axihpm0fpd/ACLK] [get_bd_pins interconnect_axihpm0fpd/M00_ACLK] \
  [get_bd_pins interconnect_axihpm0fpd/S00_ACLK] [get_bd_pins proc_sys_reset_1/slowest_sync_clk] \
  [get_bd_pins ps_e/maxihpm1_fpd_aclk] [get_bd_pins ps_e/saxi_lpd_aclk]
connect_bd_net [get_bd_pins clk_wiz_0/clk_out3] \
  [get_bd_pins axi_intc_0/s_axi_aclk] [get_bd_pins interconnect_axilite/ACLK] [get_bd_pins interconnect_axilite/M00_ACLK] \
  [get_bd_pins interconnect_axilite/S00_ACLK] [get_bd_pins proc_sys_reset_2/slowest_sync_clk] \
  [get_bd_pins ps_e/maxihpm0_lpd_aclk]
connect_bd_net [get_bd_pins clk_wiz_0/clk_out1] [get_bd_pins proc_sys_reset_0/slowest_sync_clk]
